# EAGLE schematic Complete_Board_Two_Multiplexers (EAGLE 9.3.0), part 1 of 3
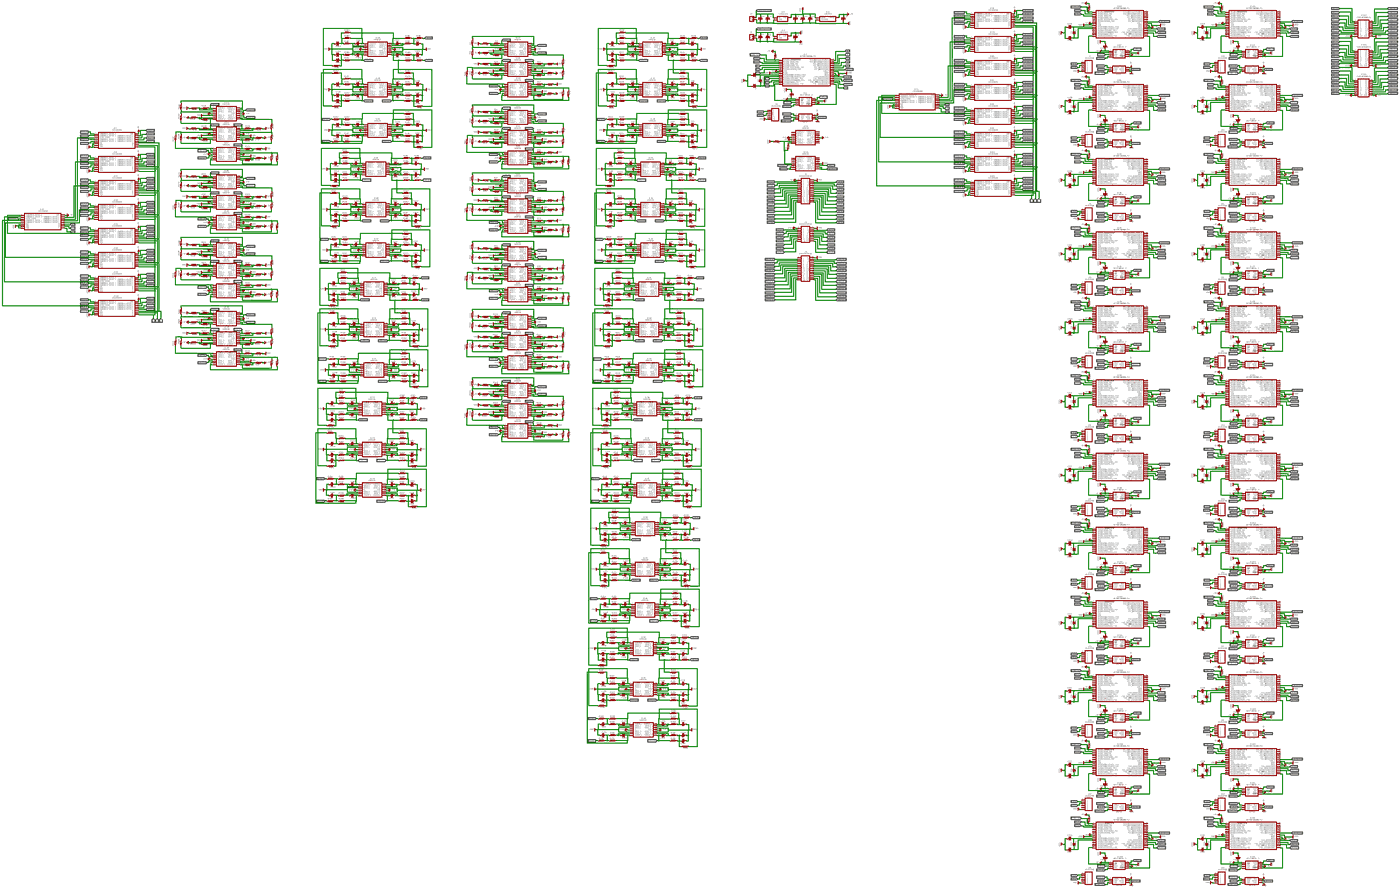
[diagram p0: schematic, sheet 1, overview]
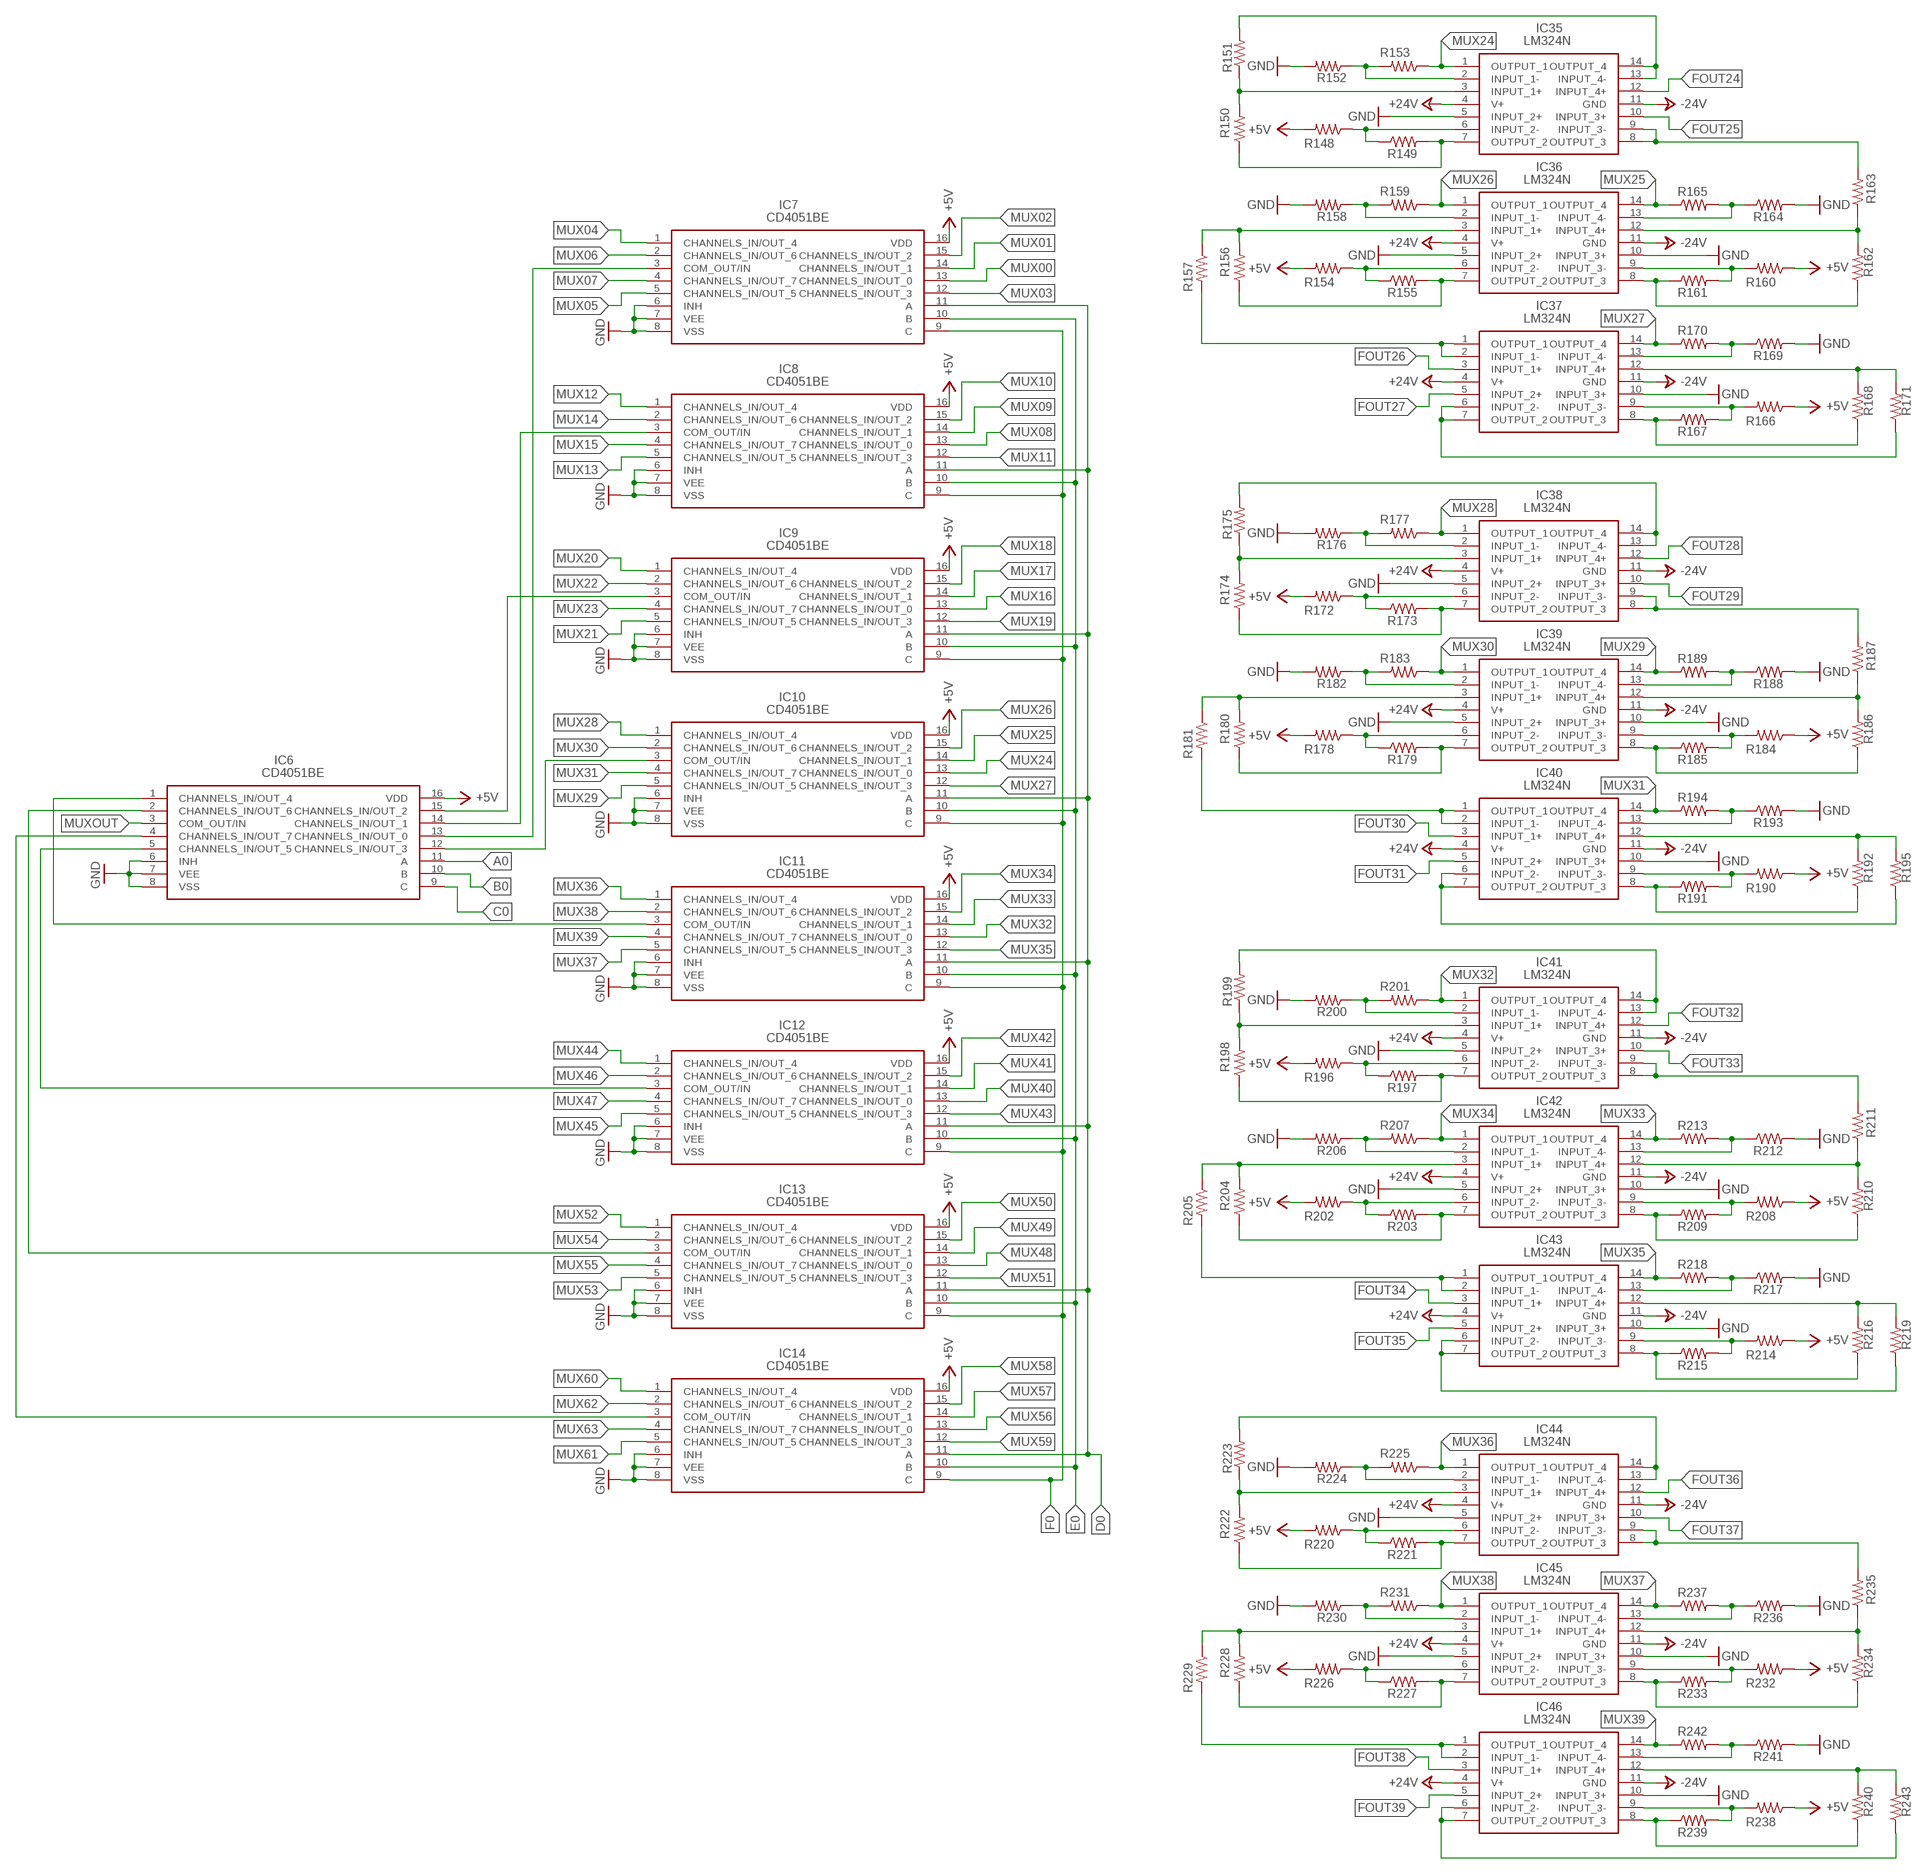
[diagram p1: schematic, sheet 1, part 1 of 8]
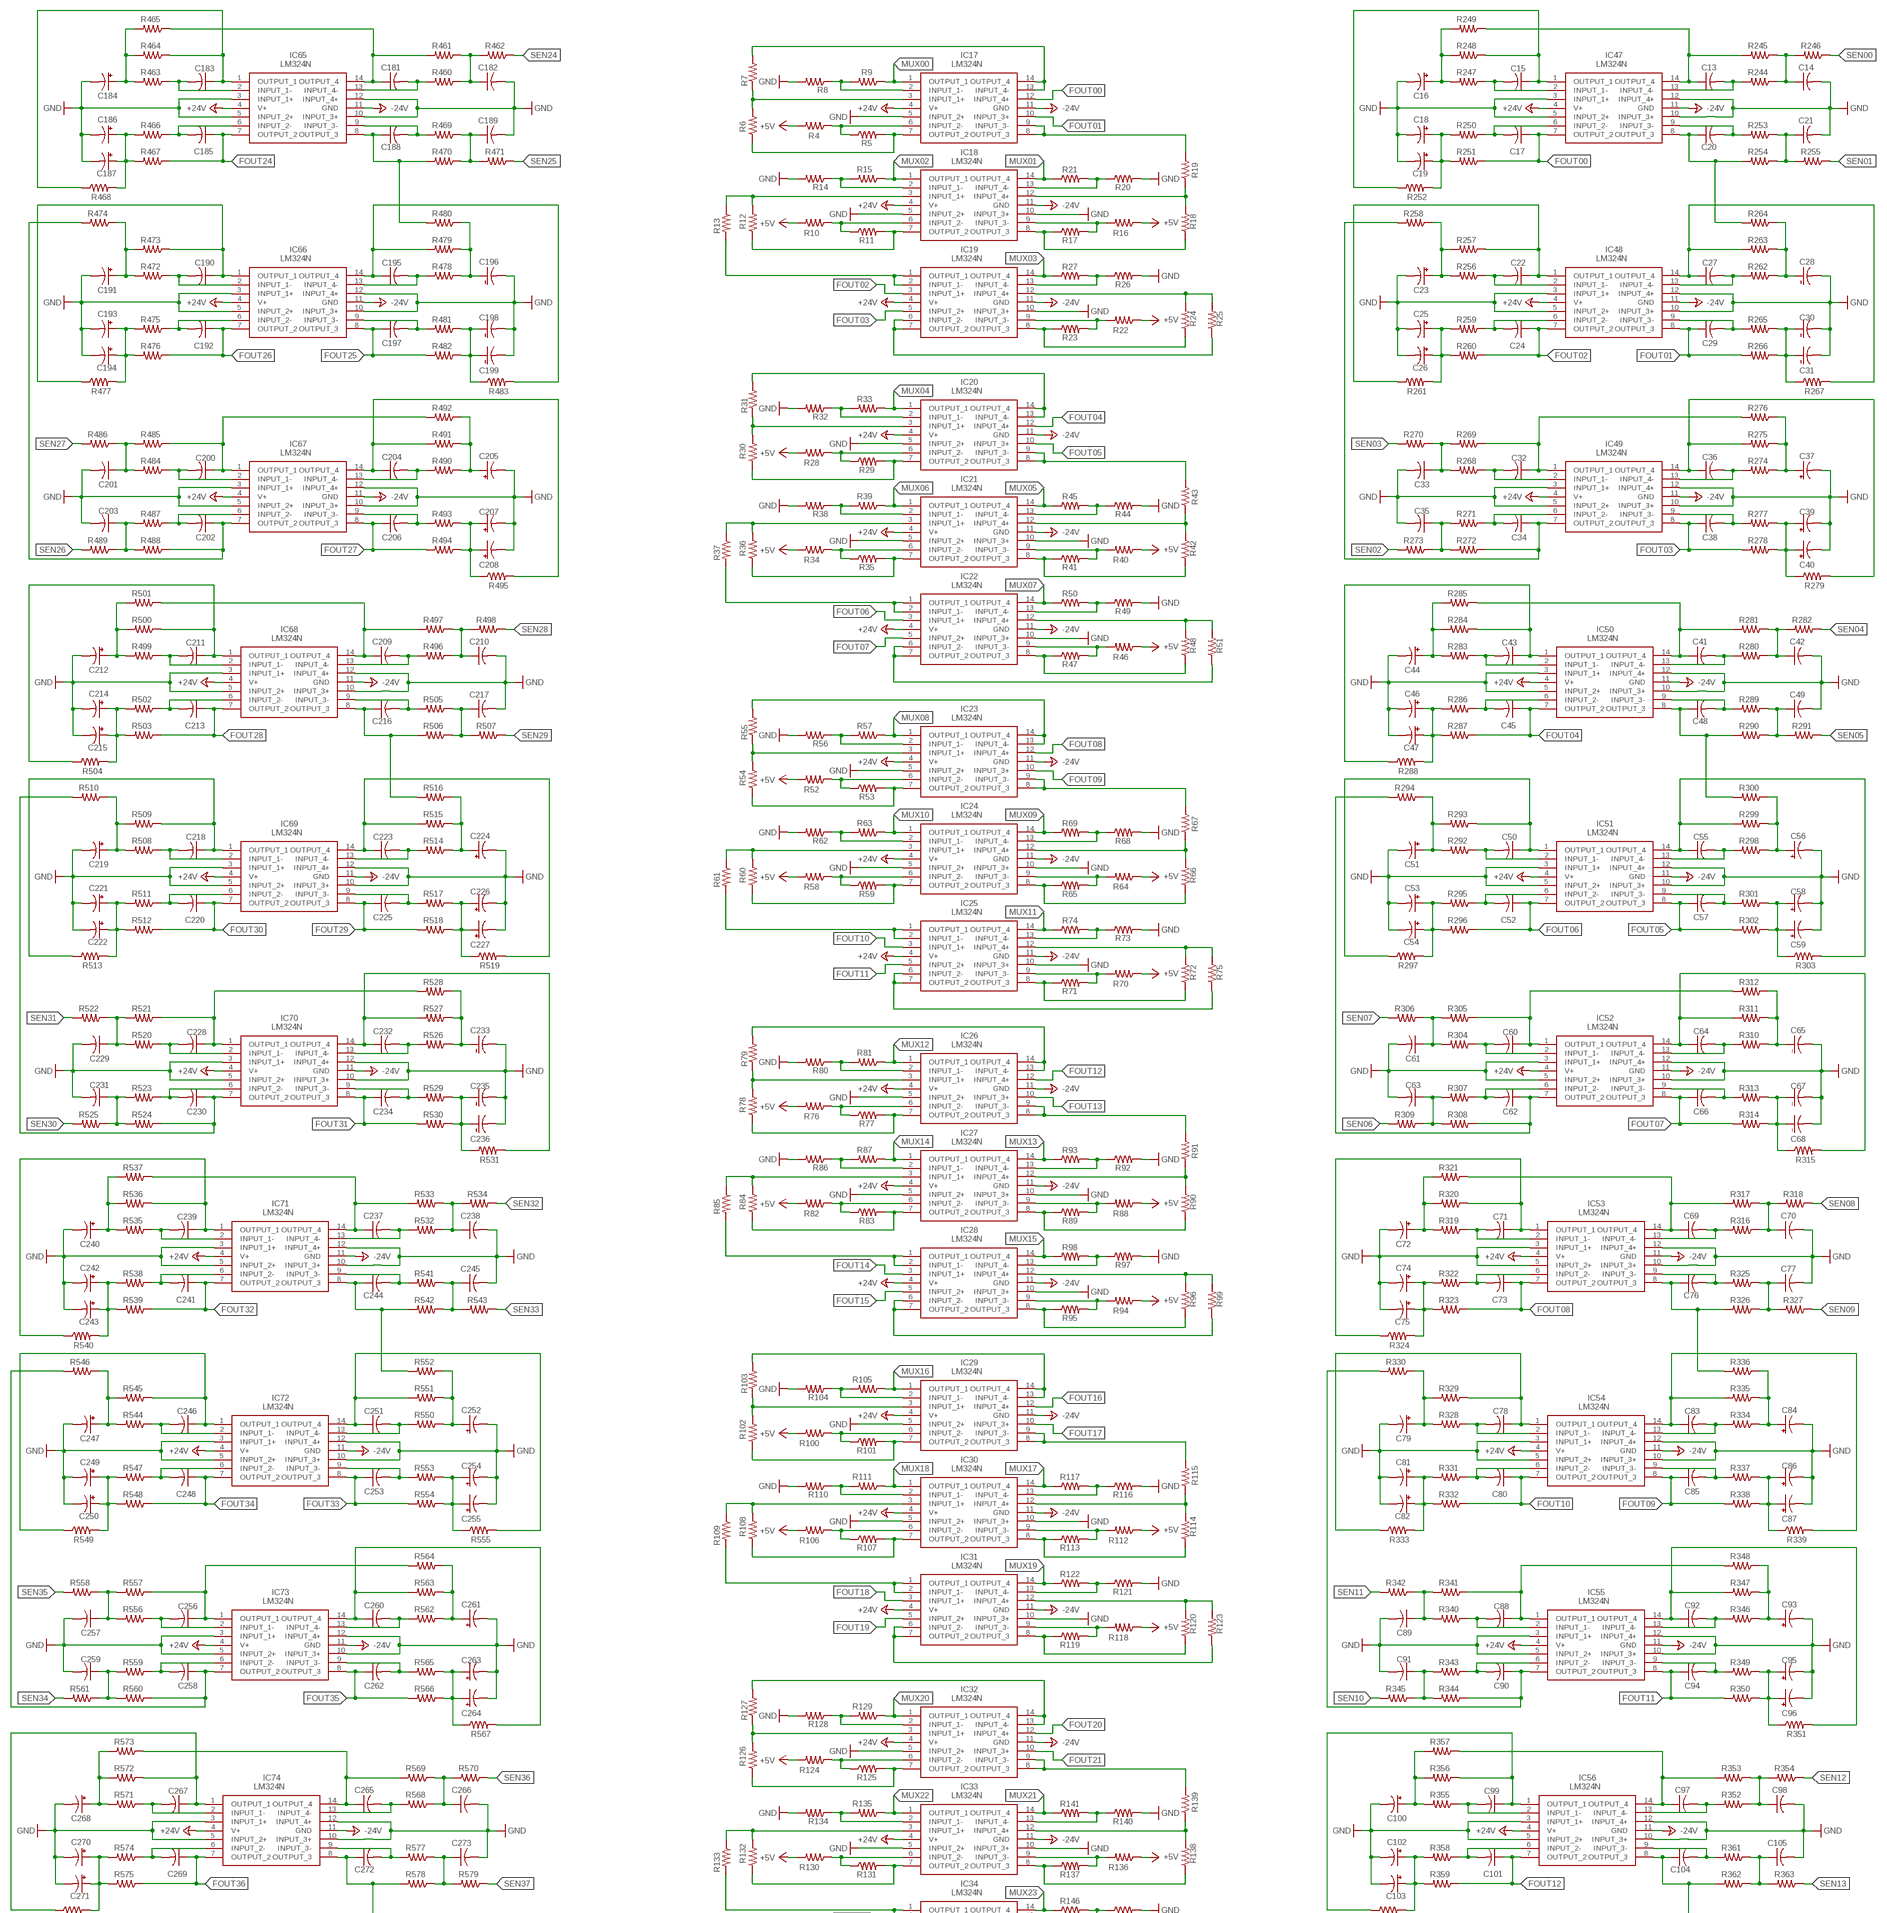
[diagram p2: schematic, sheet 1, part 2 of 8]
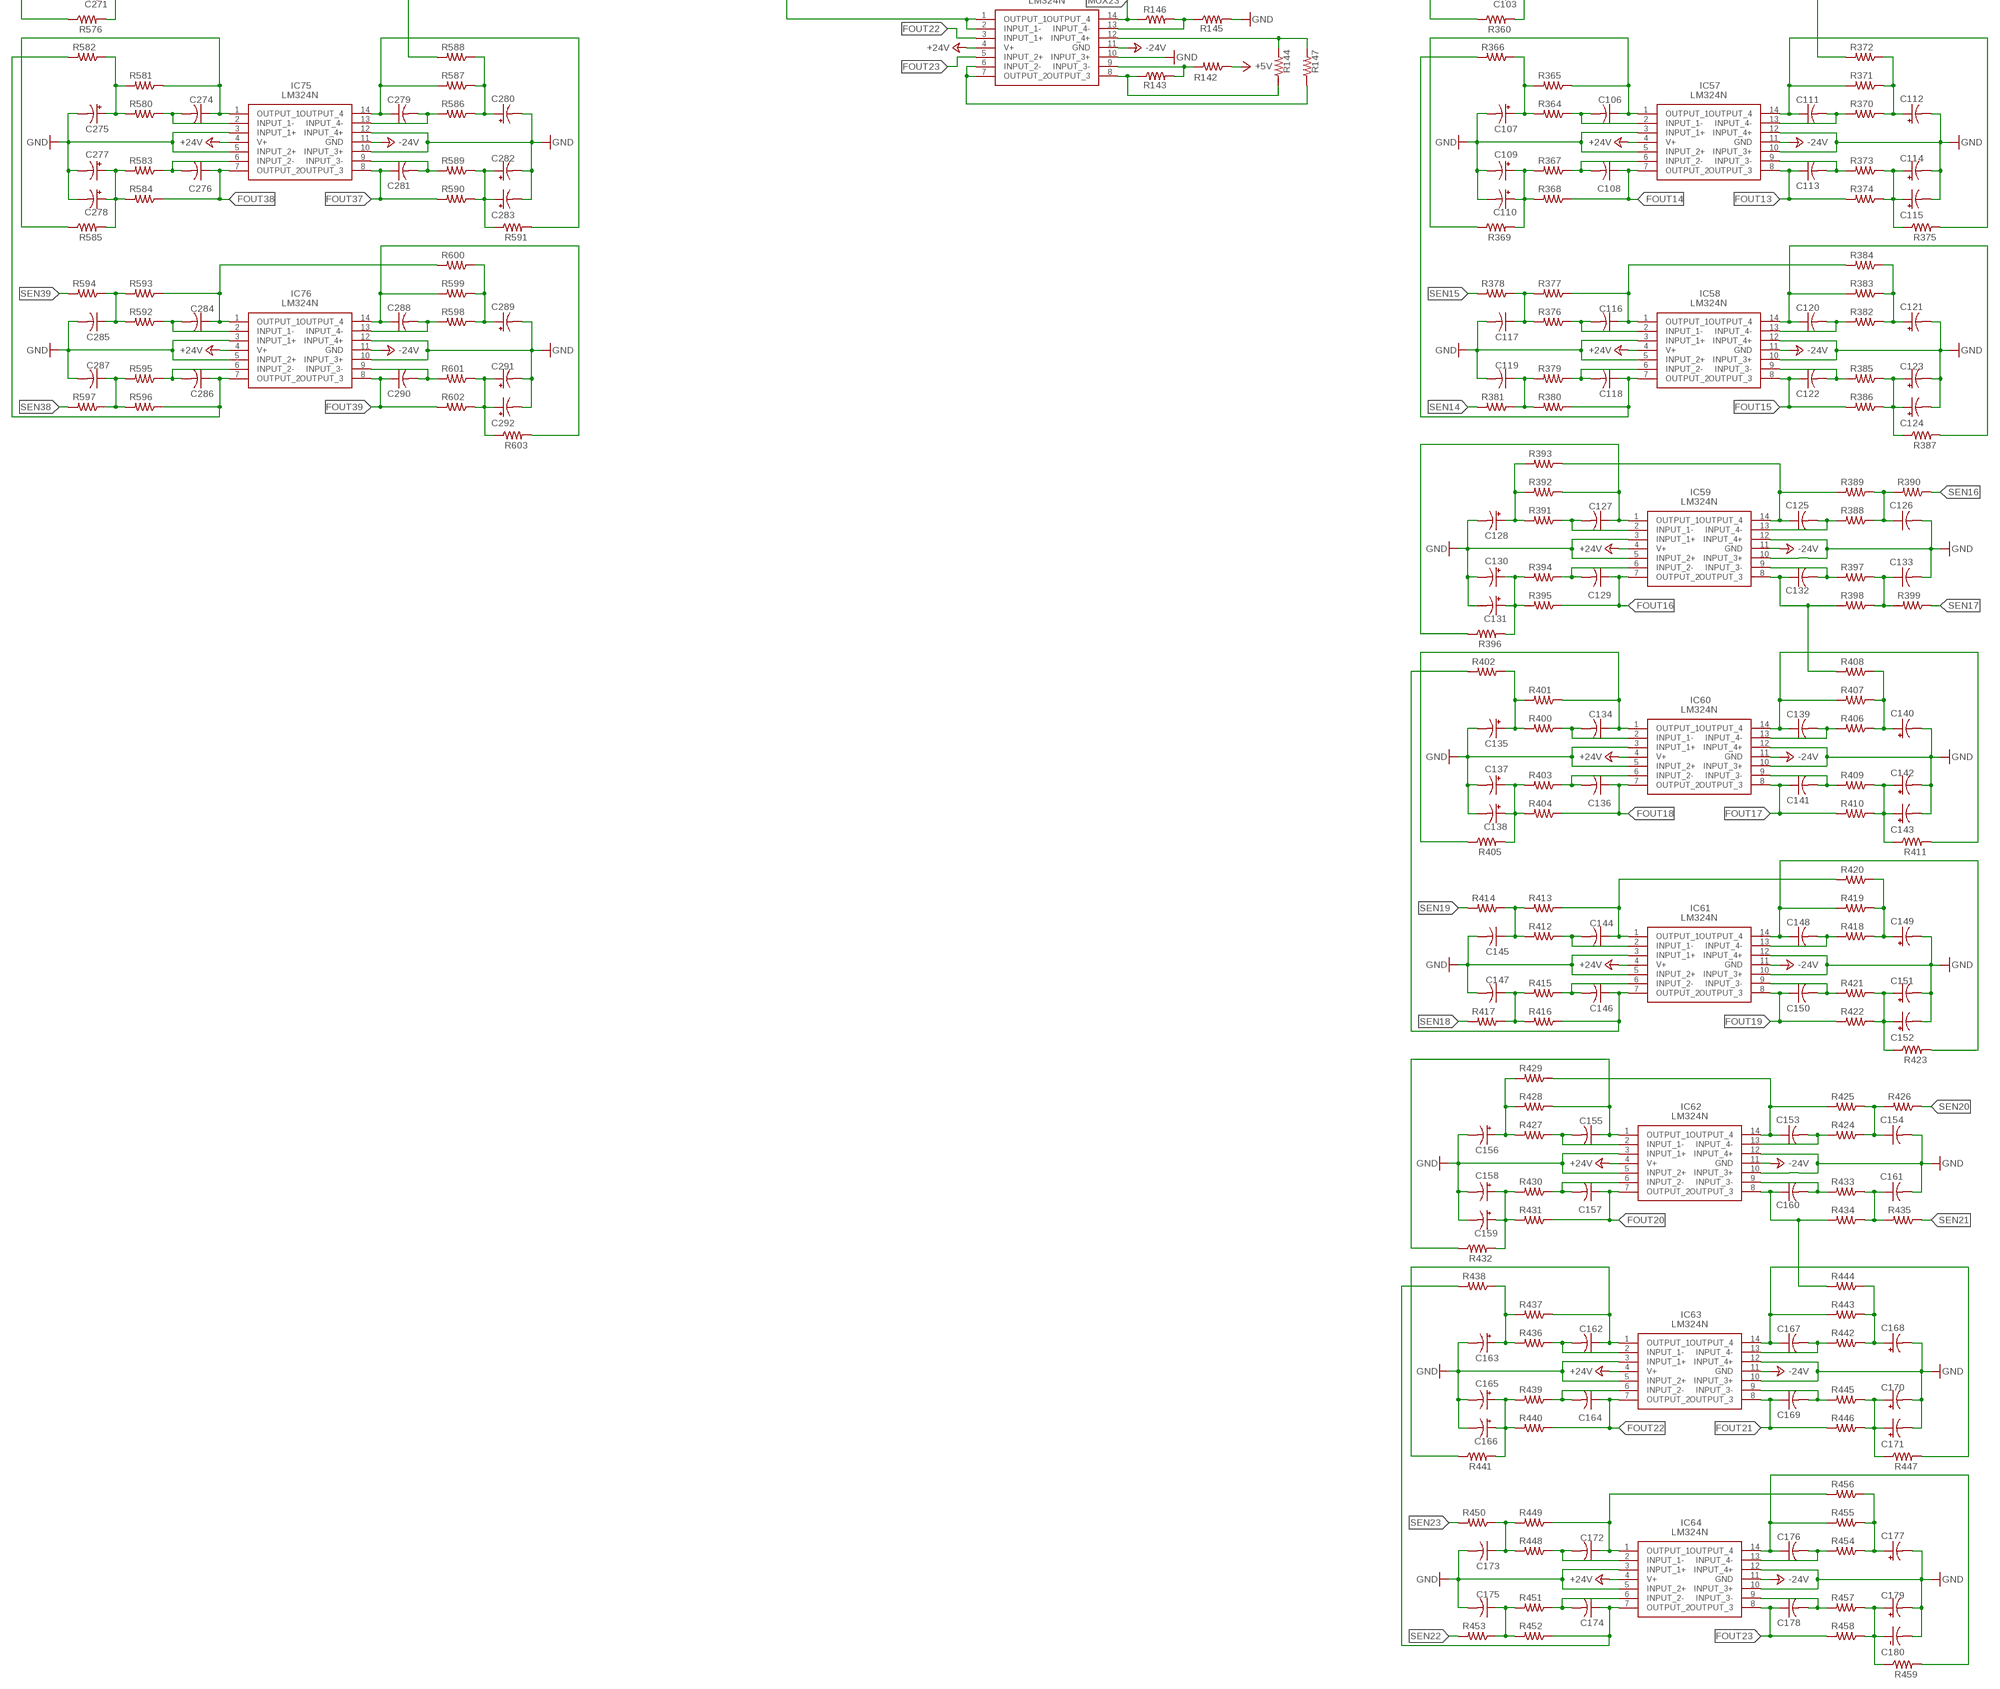
[diagram p3: schematic, sheet 1, part 3 of 8]
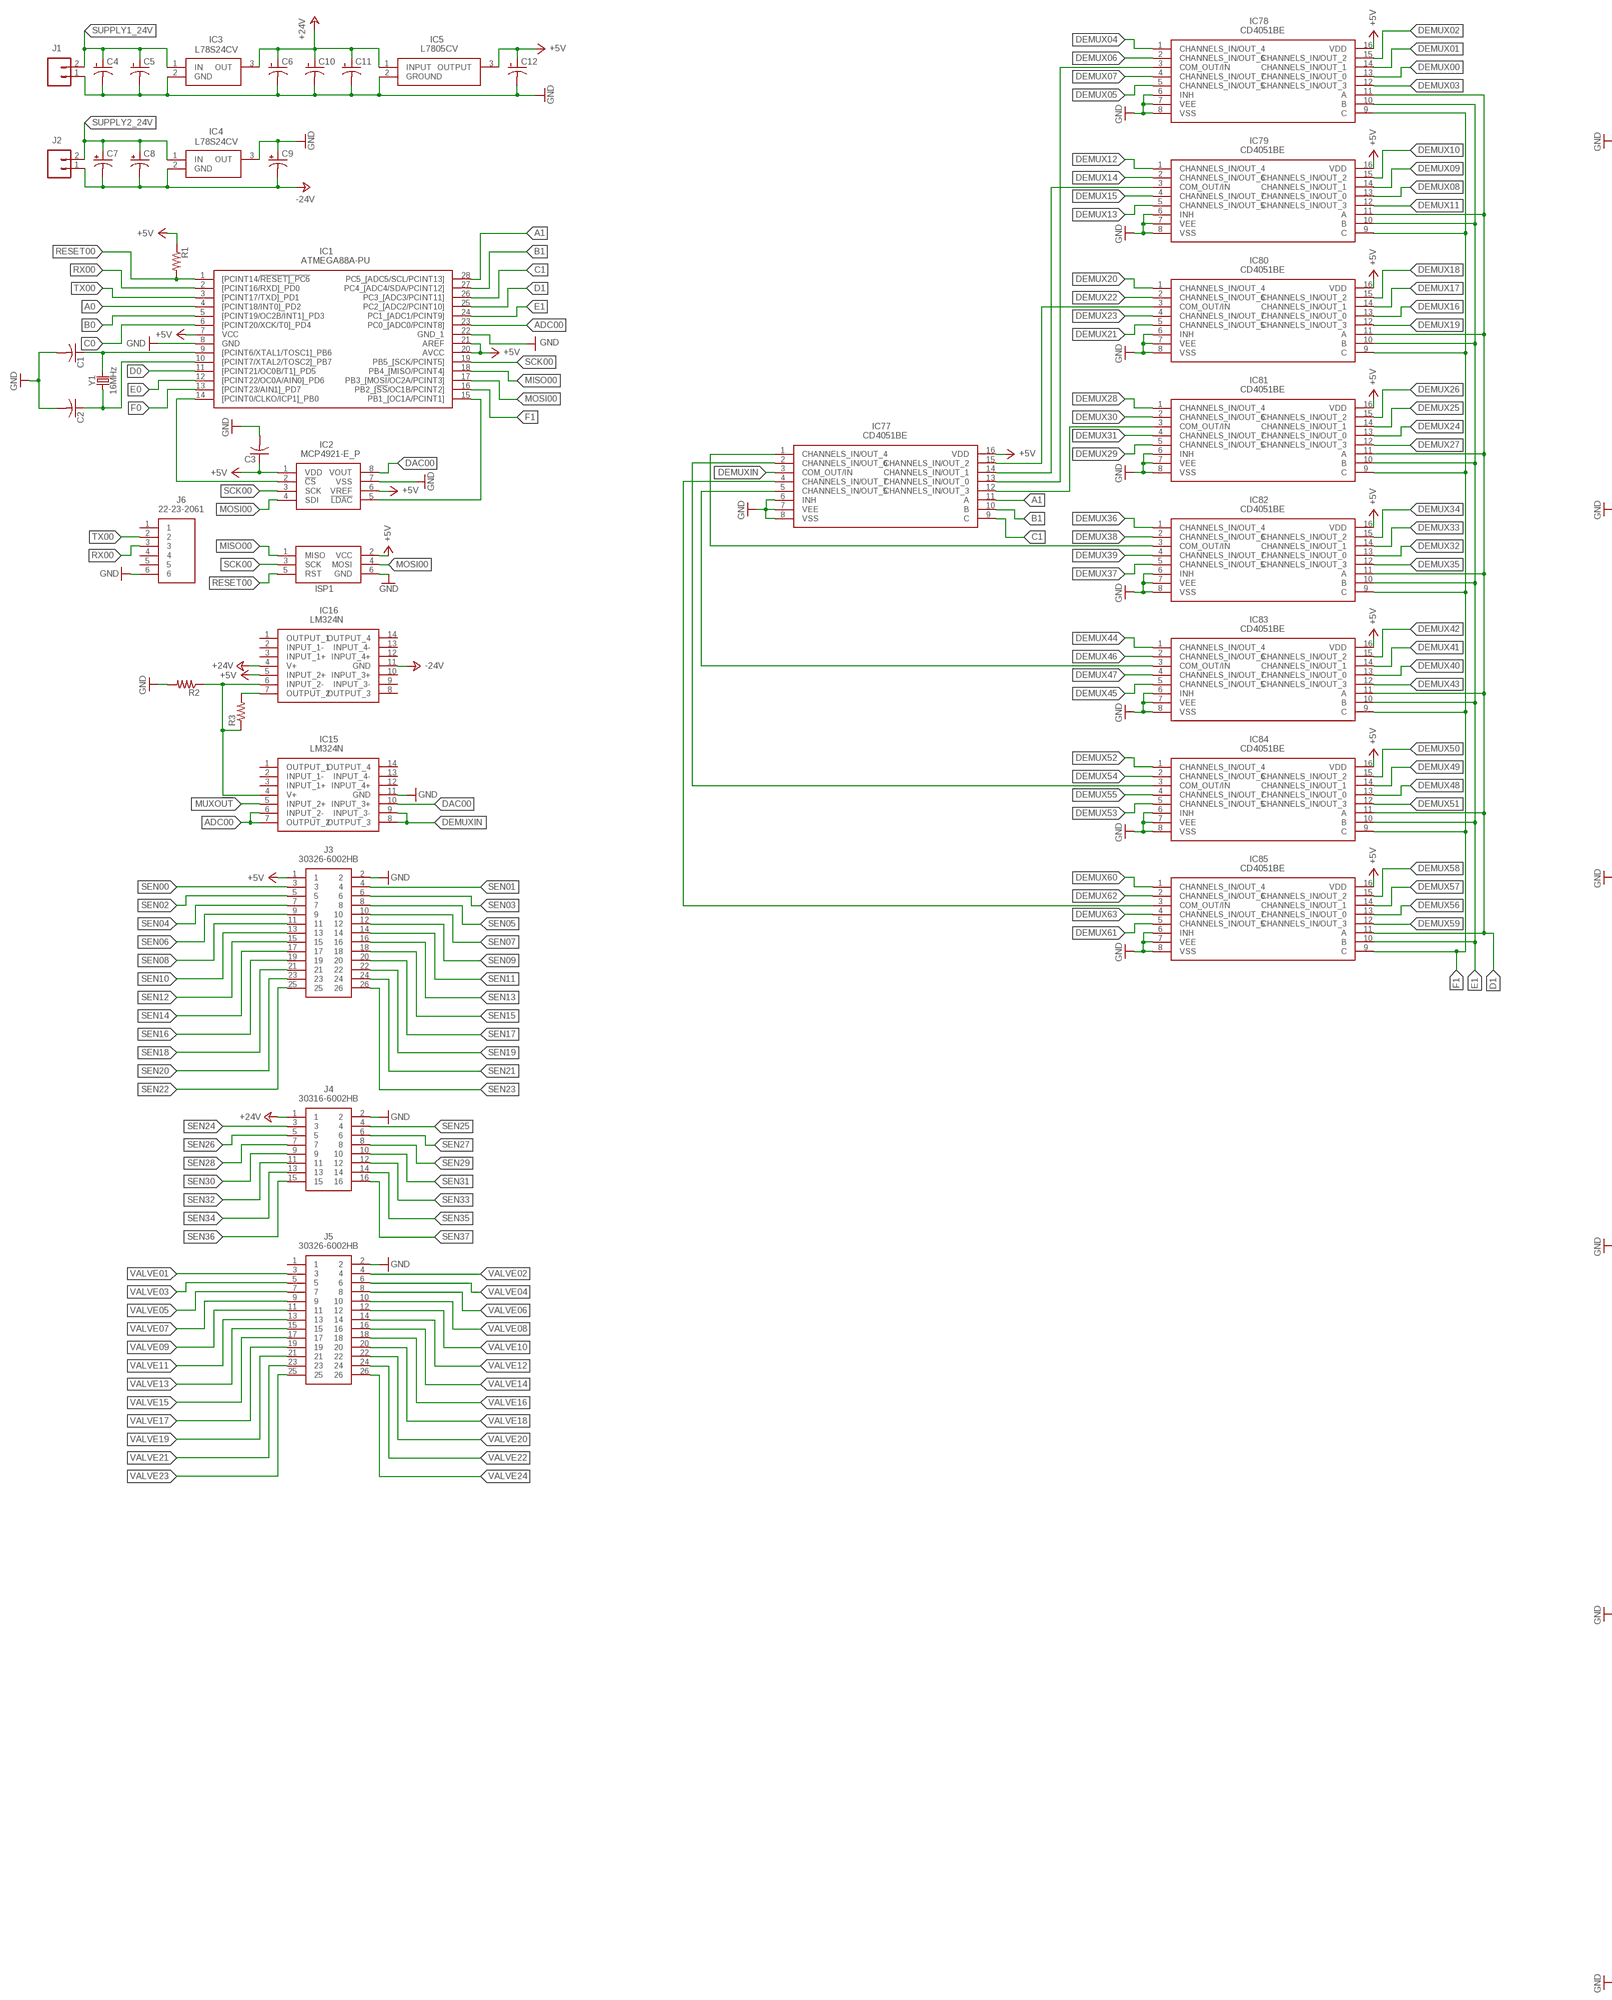
[diagram p4: schematic, sheet 1, part 4 of 8]
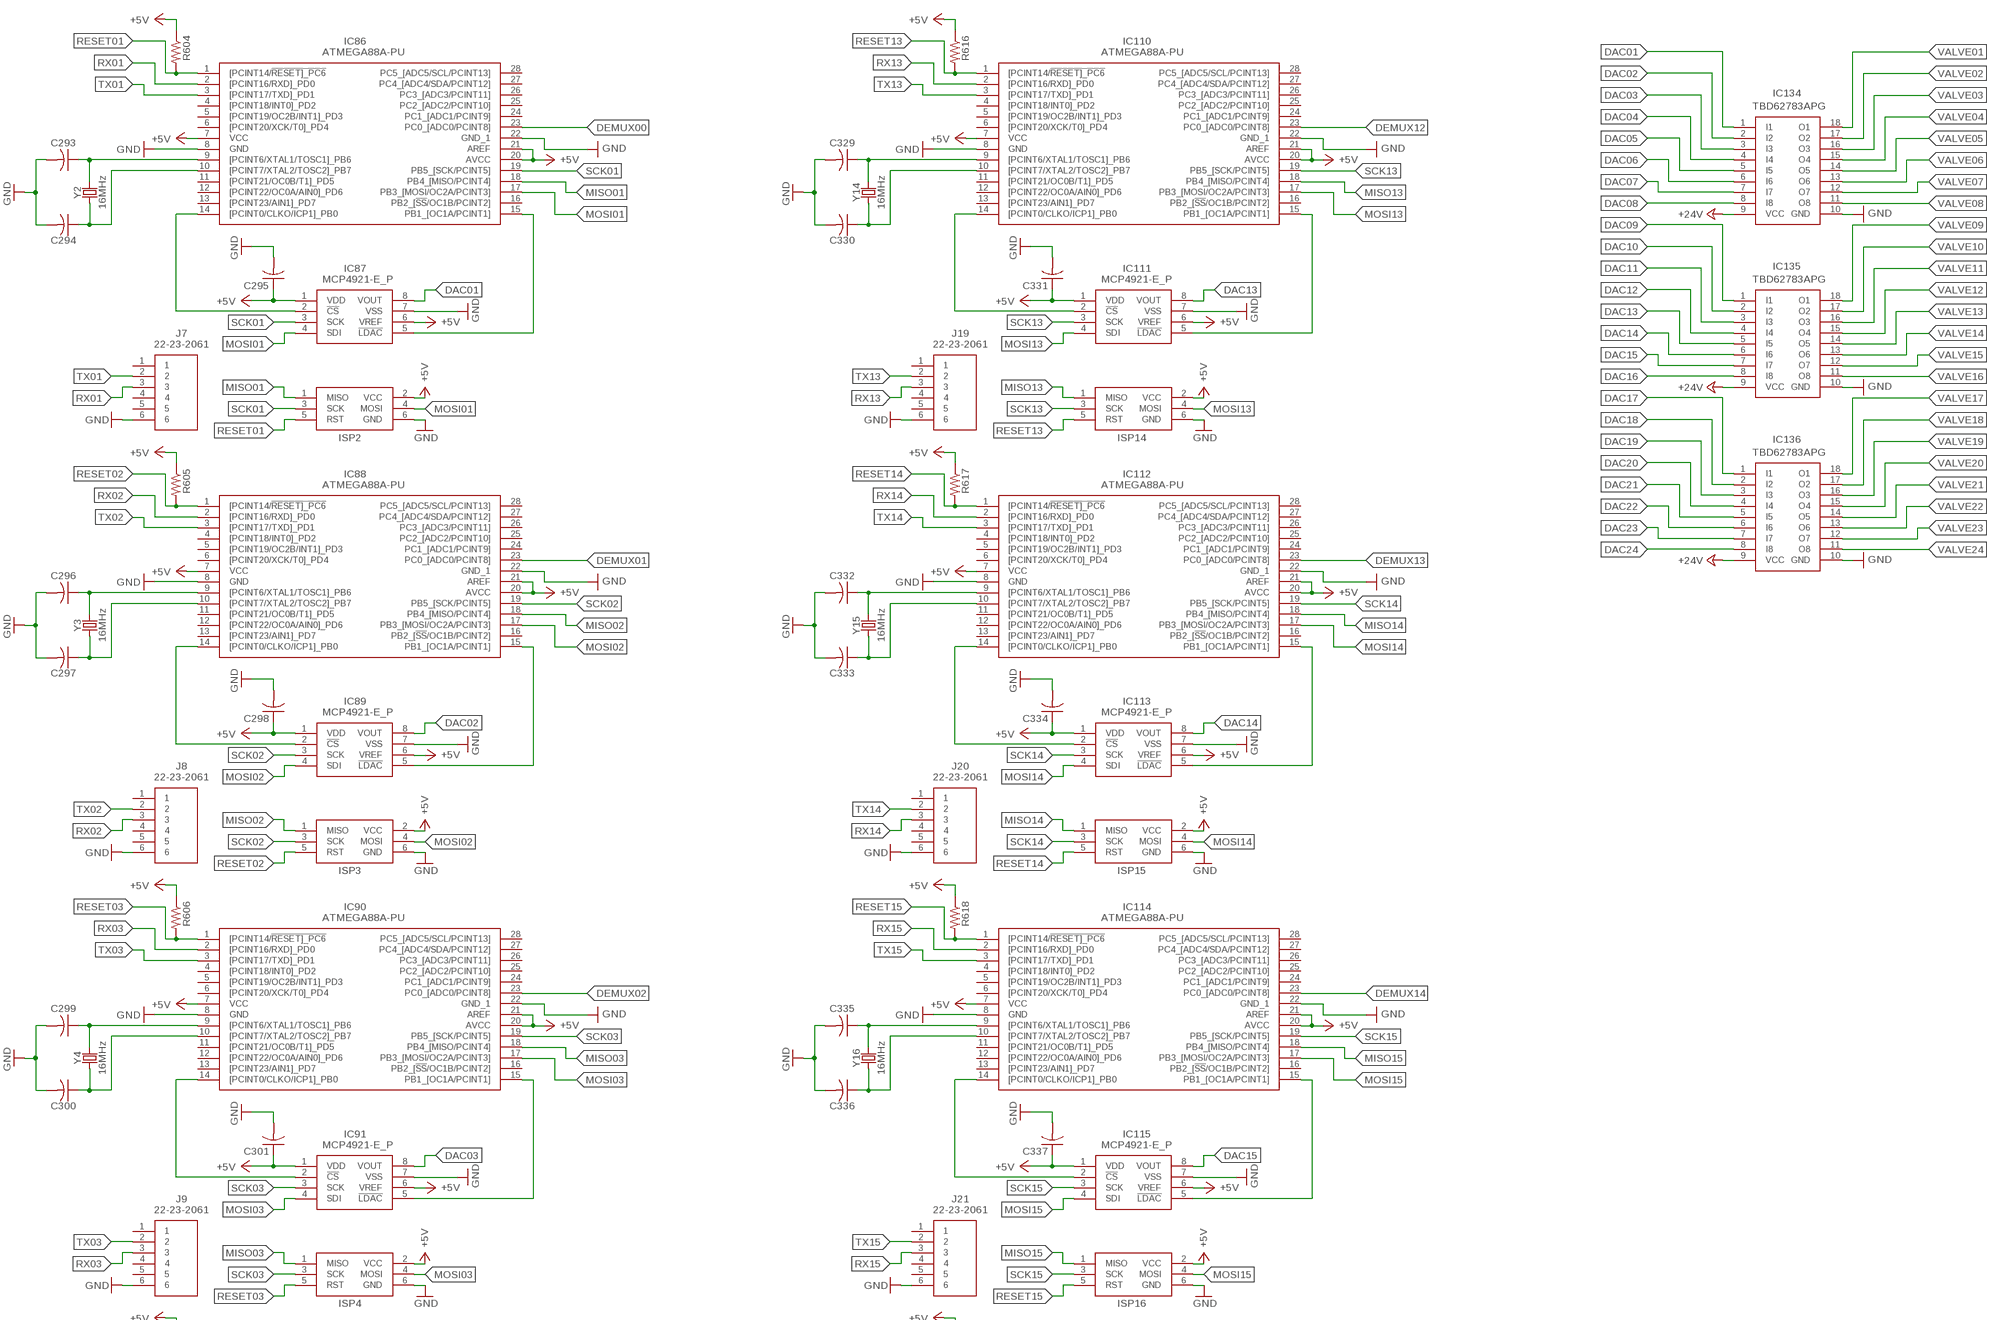
[diagram p5: schematic, sheet 1, part 5 of 8]
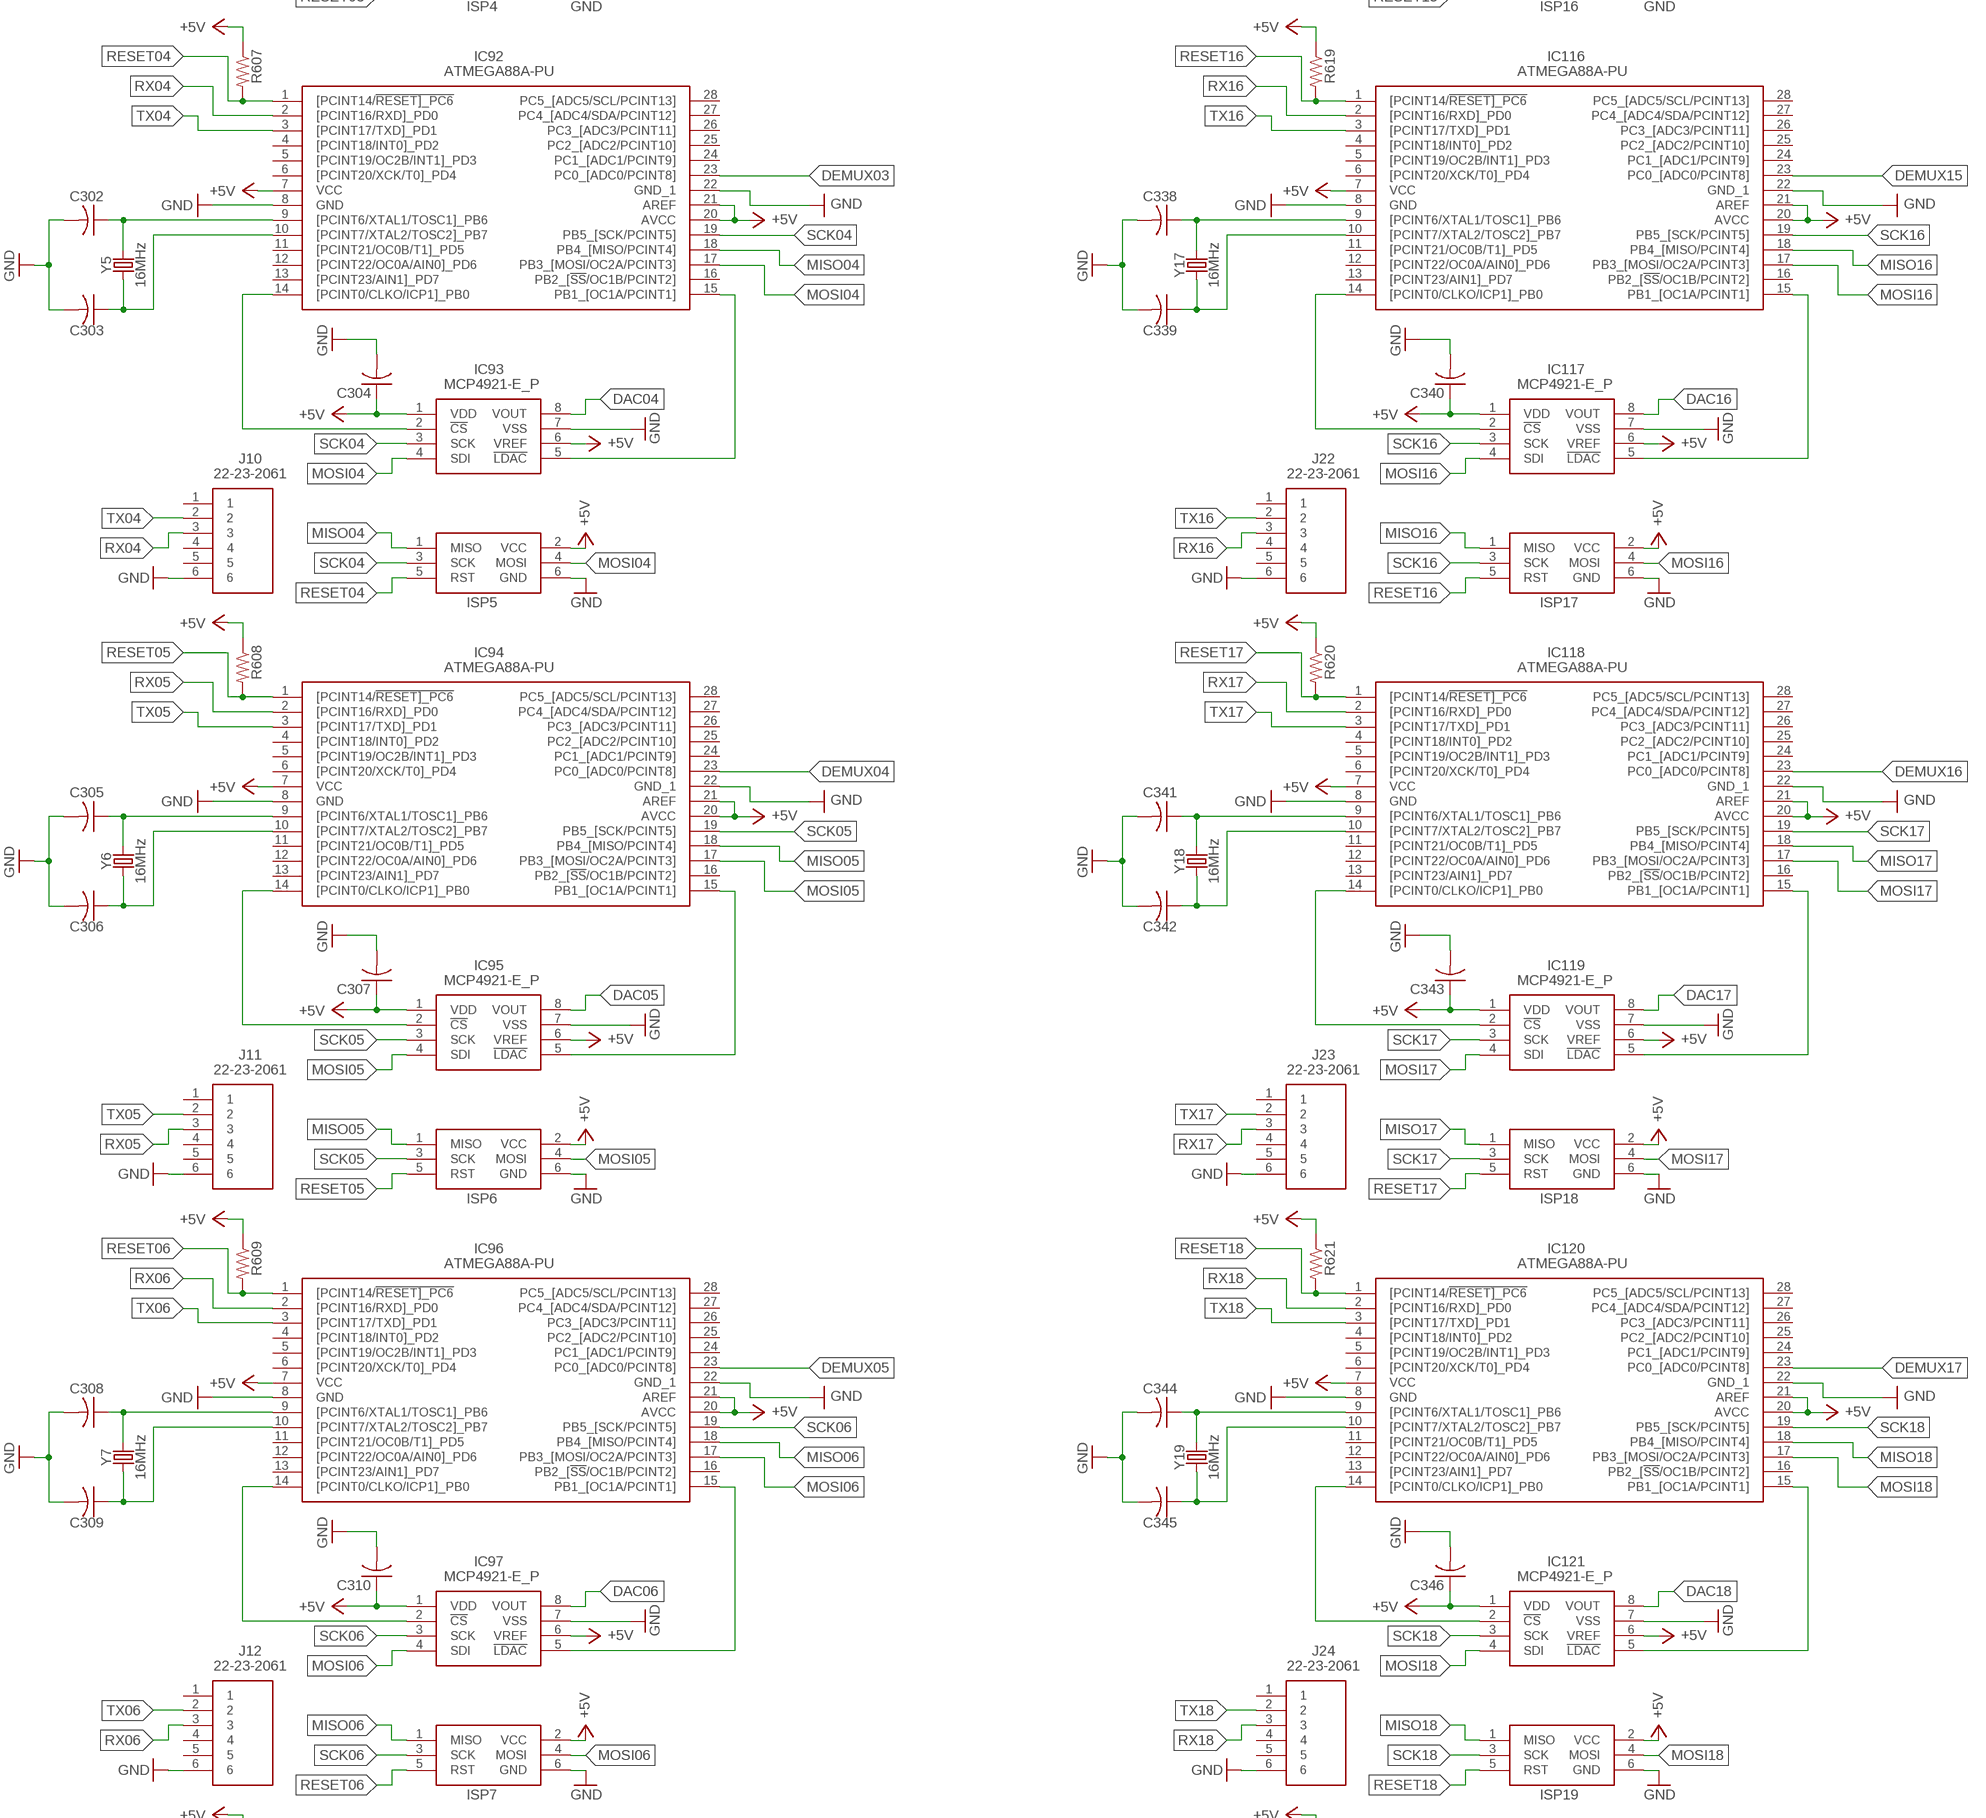
[diagram p6: schematic, sheet 1, part 6 of 8]
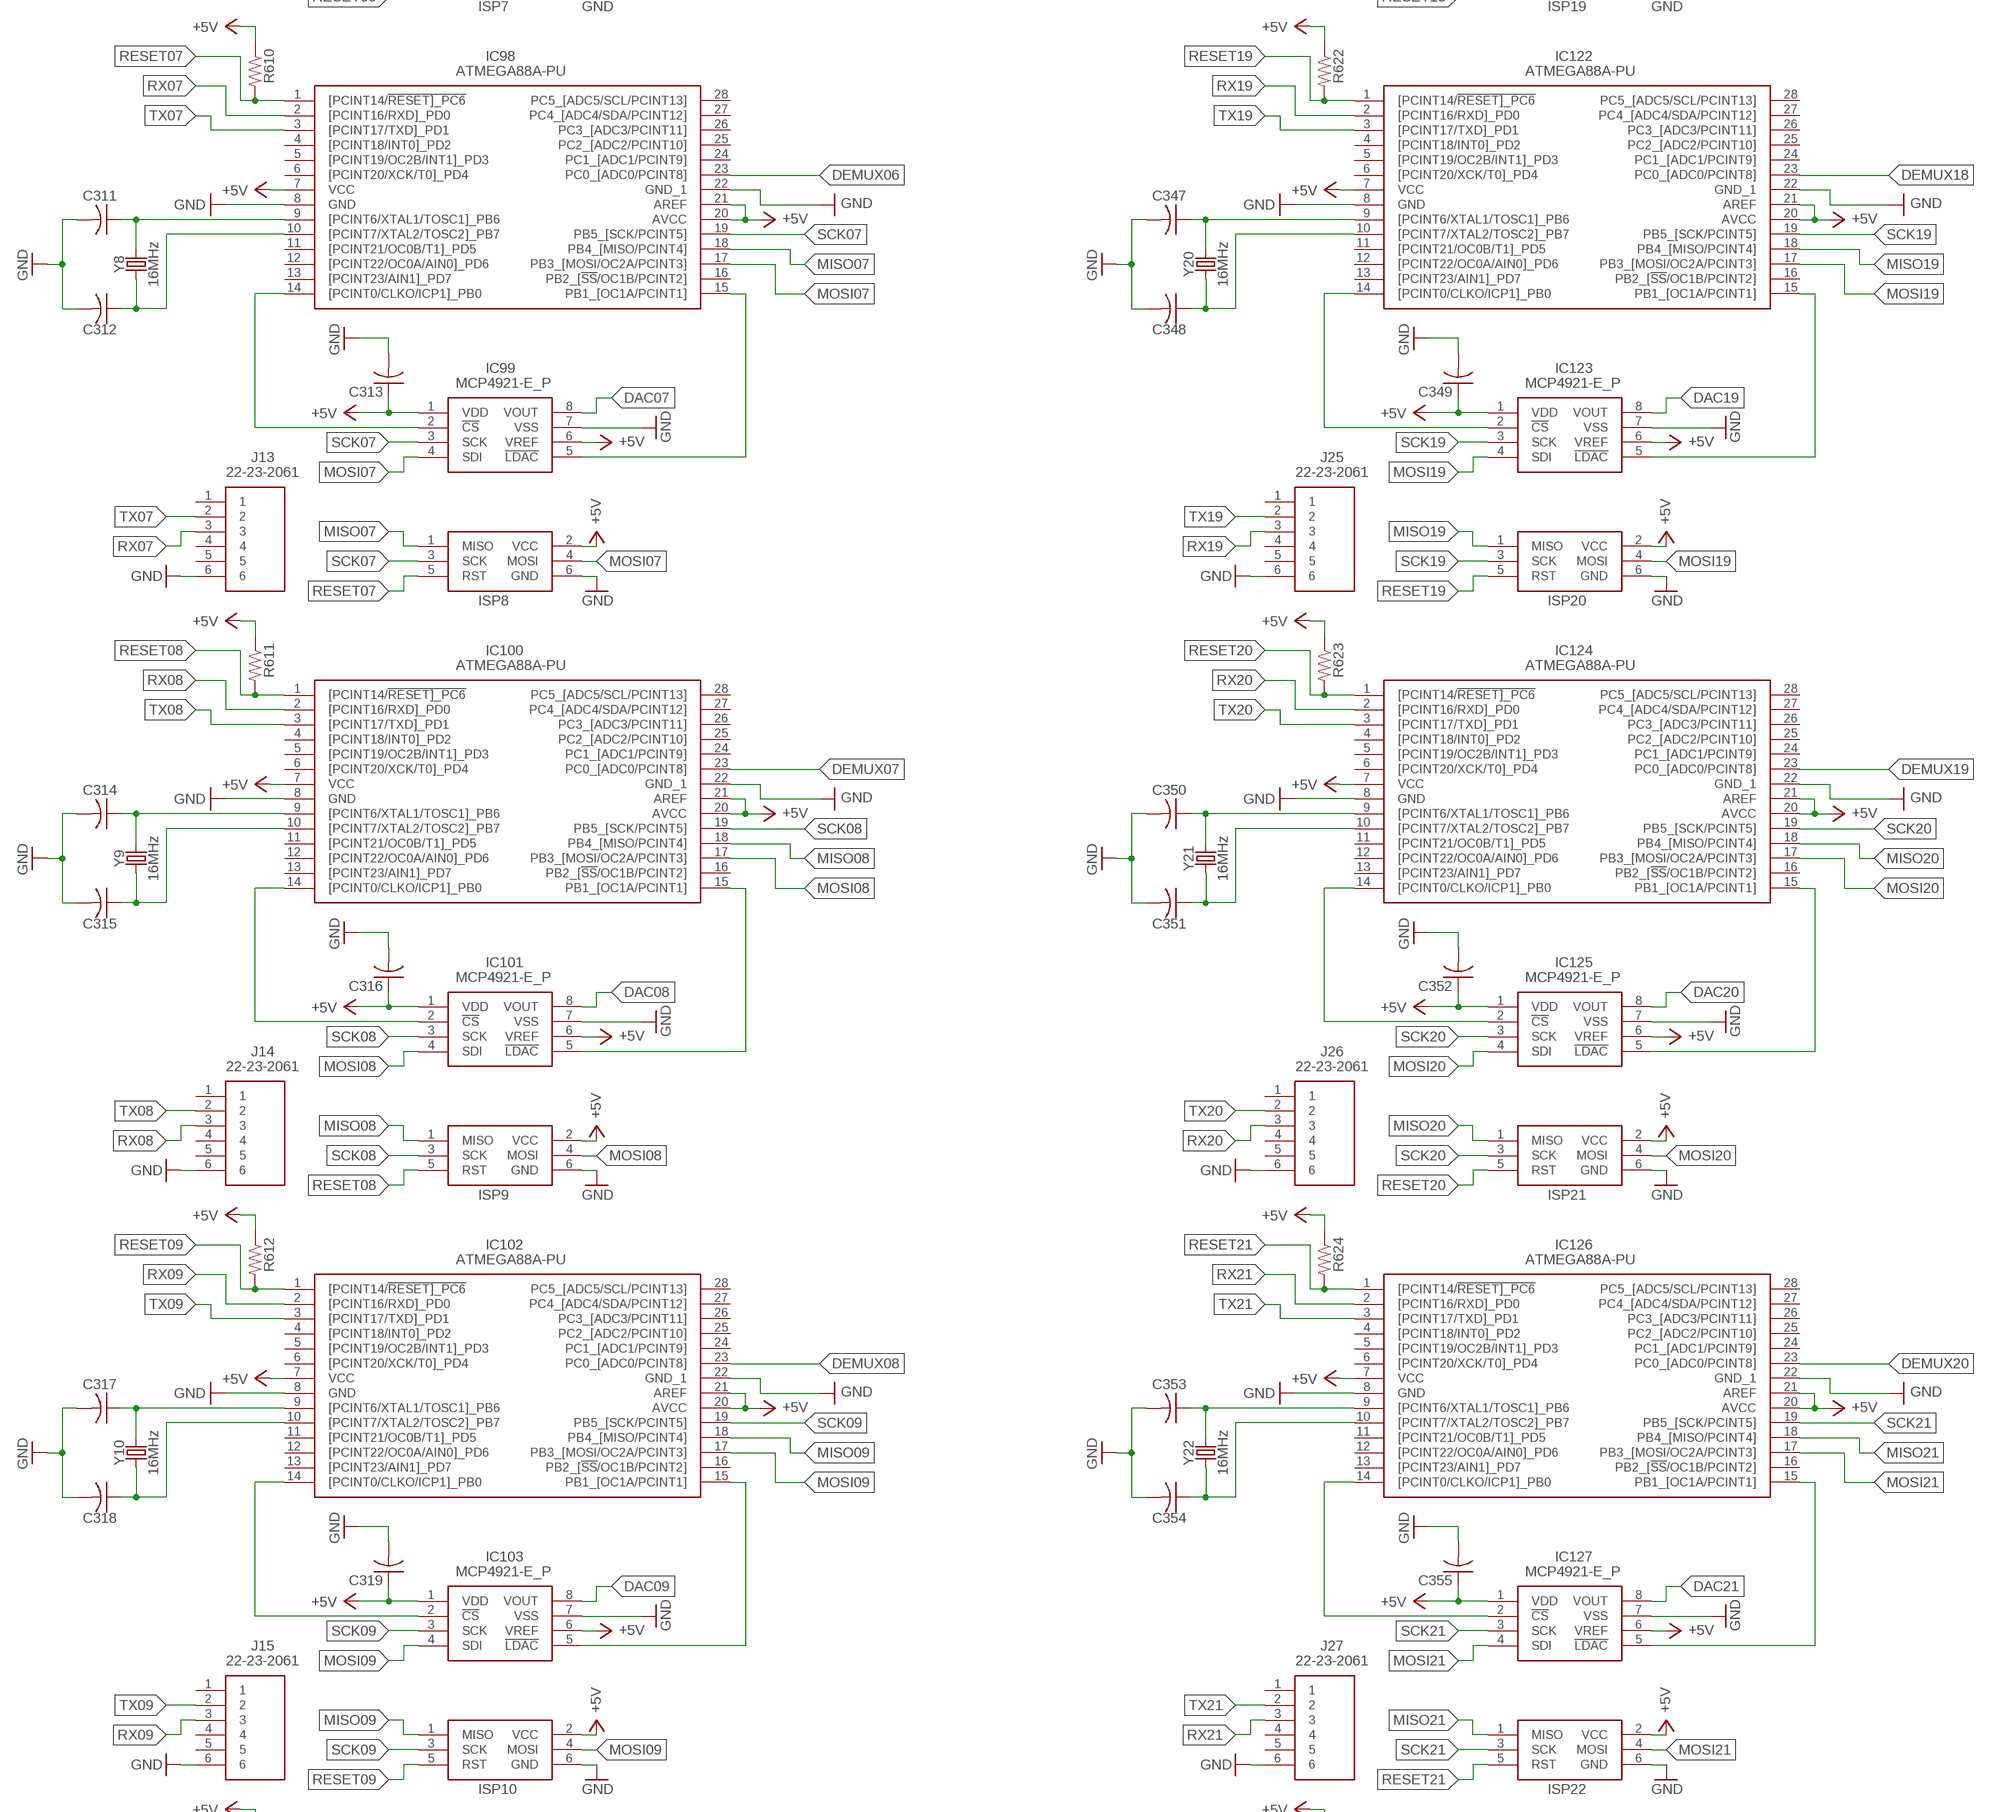
[diagram p7: schematic, sheet 1, part 7 of 8]
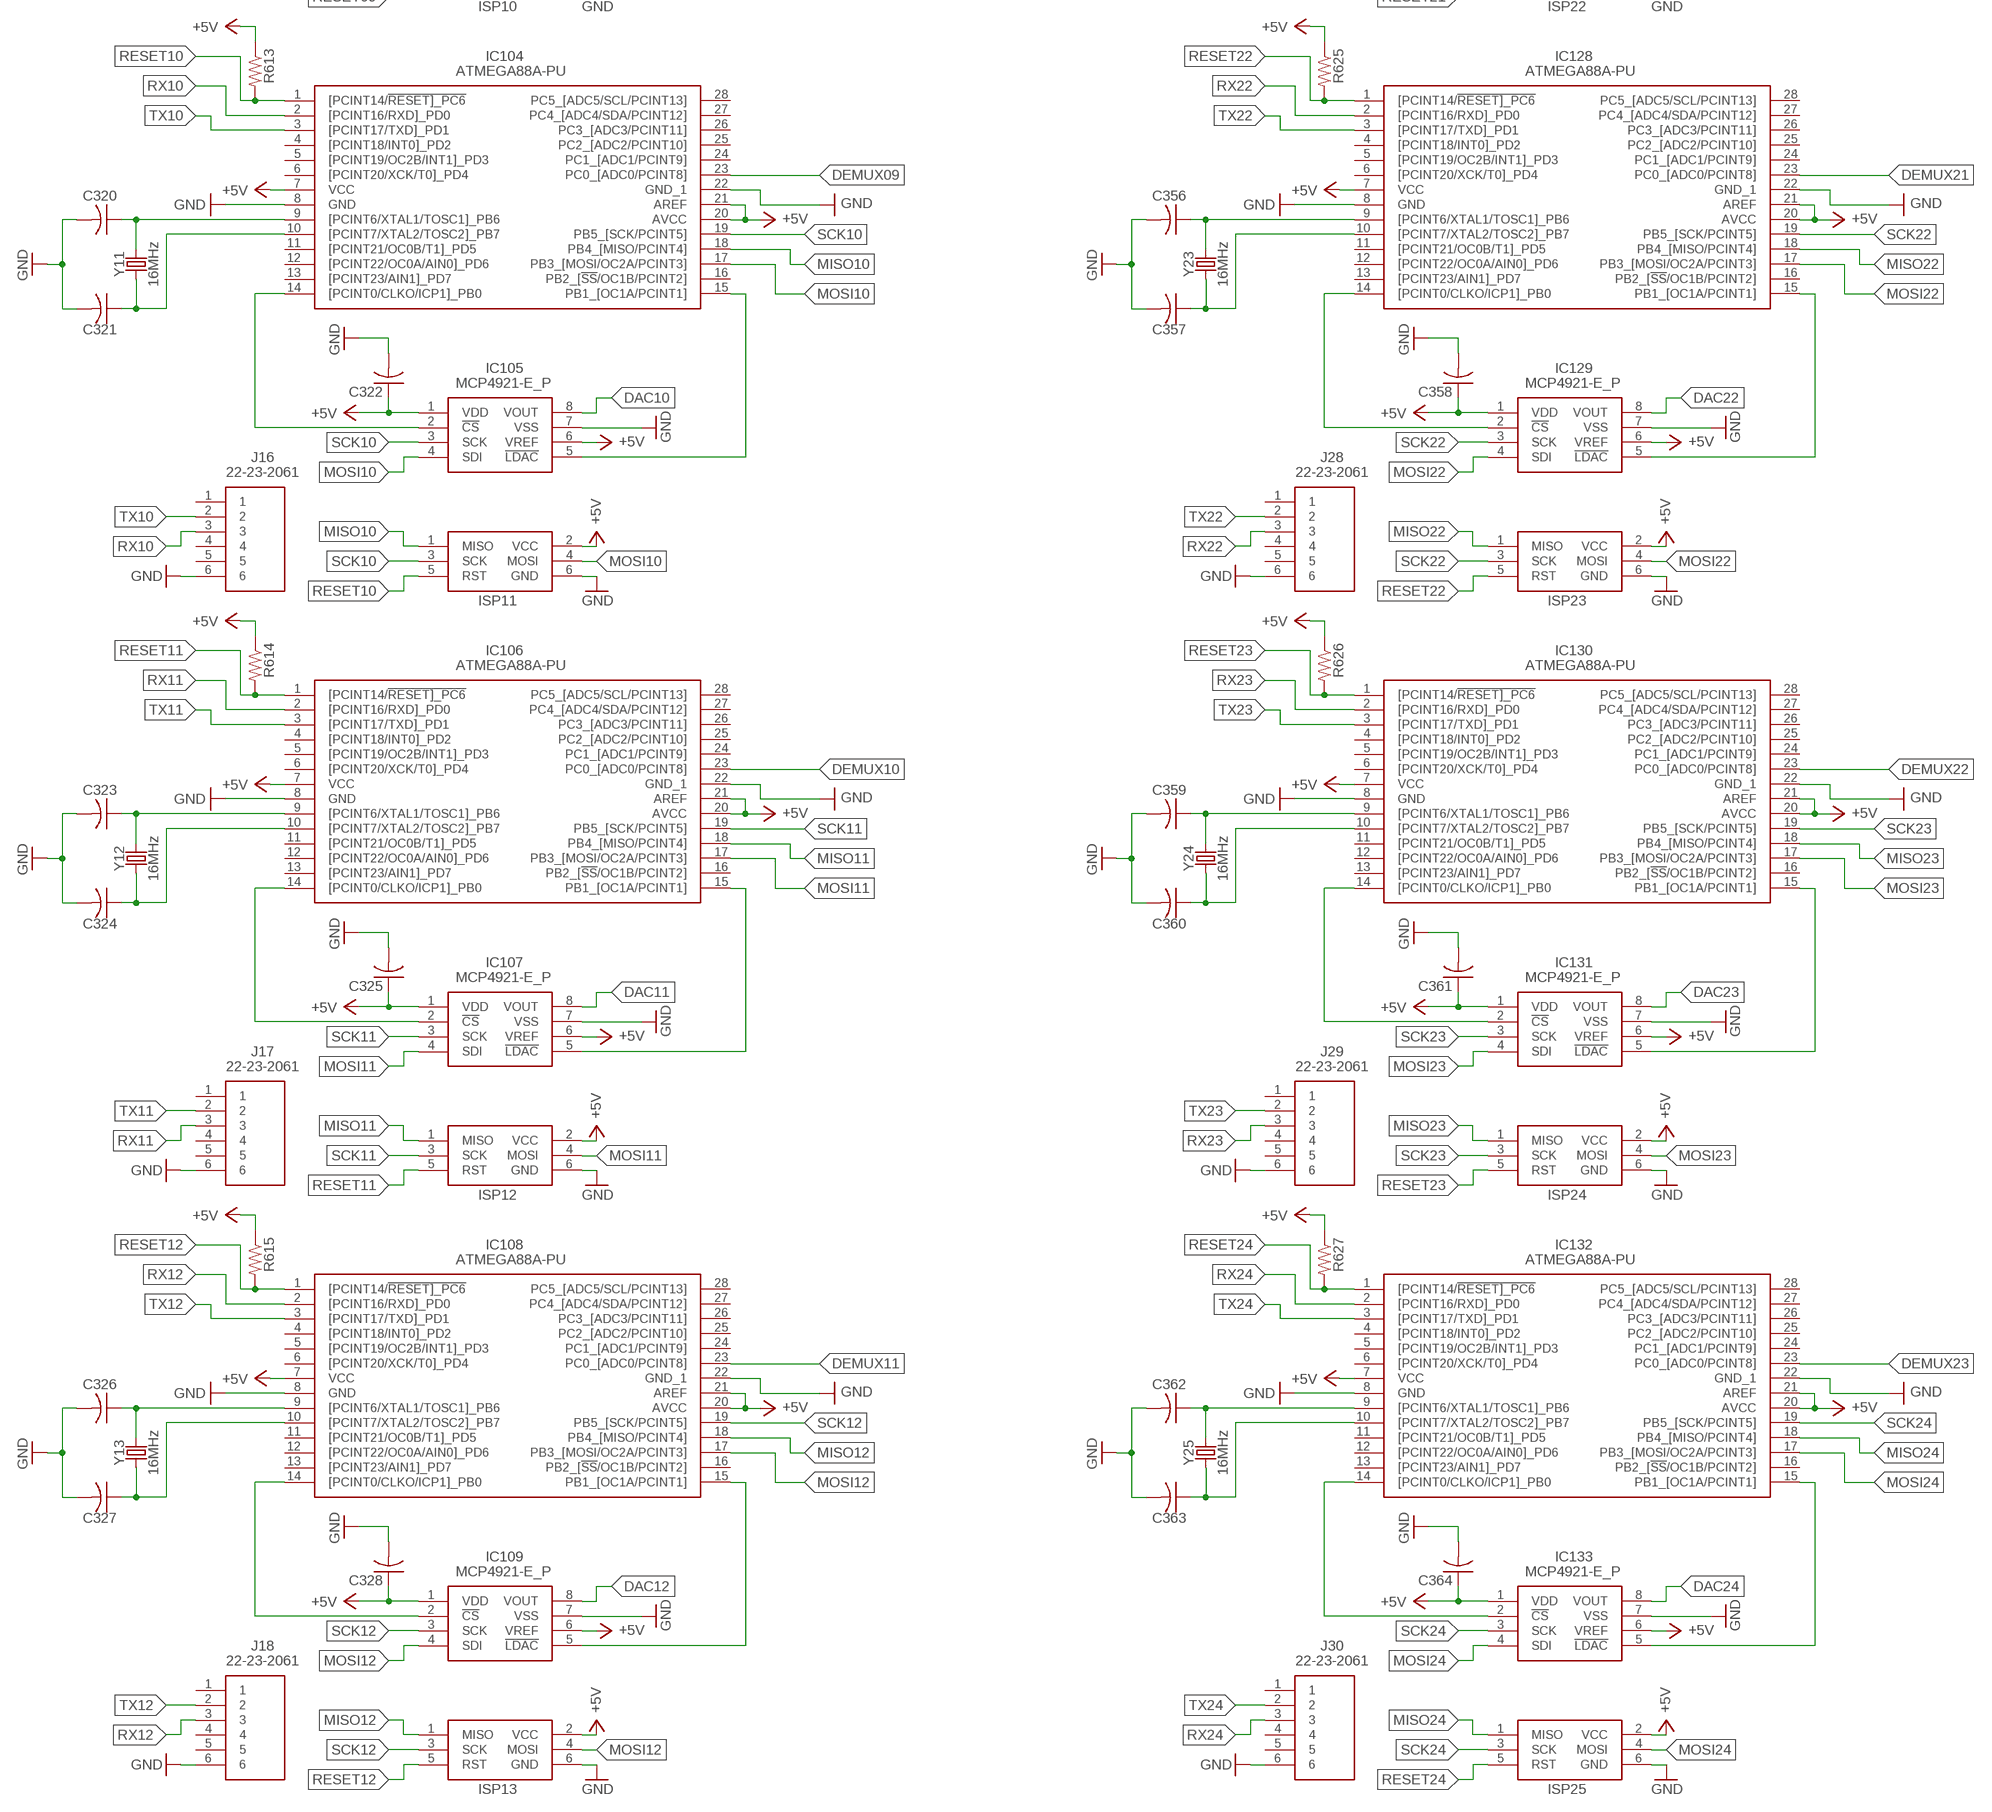
[diagram p8: schematic, sheet 1, part 8 of 8]

## Parts
C1  C-US050-030X075  [C050-030X075]
C2  C-US050-030X075  [C050-030X075]
C3  C-US050-030X075  [C050-030X075]
C4  CPOL-USE2.5-7  [E2,5-7]
C5  CPOL-USE2.5-7  [E2,5-7]
C6  CPOL-USE2.5-5  [E2,5-5]
C7  CPOL-USE2.5-7  [E2,5-7]
C8  CPOL-USE2.5-7  [E2,5-7]
C9  CPOL-USE2.5-5  [E2,5-5]
C10  CPOL-USE2.5-7  [E2,5-7]
C11  CPOL-USE2.5-7  [E2,5-7]
C12  CPOL-USE2.5-5  [E2,5-5]
C13  C-US050-030X075  [C050-030X075]
C14  C-US050-030X075  [C050-030X075]
C15  C-US050-030X075  [C050-030X075]
C16  CPOL-USE2.5-5  [E2,5-5]
C17  C-US050-030X075  [C050-030X075]
C18  CPOL-USE2.5-7  [E2,5-7]
C19  CPOL-USE2.5-7  [E2,5-7]
C20  C-US050-030X075  [C050-030X075]
C21  C-US050-030X075  [C050-030X075]
C22  C-US050-030X075  [C050-030X075]
C23  CPOL-USE2.5-5  [E2,5-5]
C24  C-US050-030X075  [C050-030X075]
C25  CPOL-USE2.5-7  [E2,5-7]
C26  CPOL-USE2.5-7  [E2,5-7]
C27  C-US050-030X075  [C050-030X075]
C28  CPOL-USE2.5-5  [E2,5-5]
C29  C-US050-030X075  [C050-030X075]
C30  CPOL-USE2.5-7  [E2,5-7]
C31  CPOL-USE2.5-7  [E2,5-7]
C32  C-US050-030X075  [C050-030X075]
C33  C-US050-030X075  [C050-030X075]
C34  C-US050-030X075  [C050-030X075]
C35  C-US050-030X075  [C050-030X075]
C36  C-US050-030X075  [C050-030X075]
C37  CPOL-USE2.5-5  [E2,5-5]
C38  C-US050-030X075  [C050-030X075]
C39  CPOL-USE2.5-7  [E2,5-7]
C40  CPOL-USE2.5-7  [E2,5-7]
C41  C-US050-030X075  [C050-030X075]
C42  C-US050-030X075  [C050-030X075]
C43  C-US050-030X075  [C050-030X075]
C44  CPOL-USE2.5-5  [E2,5-5]
C45  C-US050-030X075  [C050-030X075]
C46  CPOL-USE2.5-7  [E2,5-7]
C47  CPOL-USE2.5-7  [E2,5-7]
C48  C-US050-030X075  [C050-030X075]
C49  C-US050-030X075  [C050-030X075]
C50  C-US050-030X075  [C050-030X075]
C51  CPOL-USE2.5-5  [E2,5-5]
C52  C-US050-030X075  [C050-030X075]
C53  CPOL-USE2.5-7  [E2,5-7]
C54  CPOL-USE2.5-7  [E2,5-7]
C55  C-US050-030X075  [C050-030X075]
C56  CPOL-USE2.5-5  [E2,5-5]
C57  C-US050-030X075  [C050-030X075]
C58  CPOL-USE2.5-7  [E2,5-7]
C59  CPOL-USE2.5-7  [E2,5-7]
C60  C-US050-030X075  [C050-030X075]
C61  C-US050-030X075  [C050-030X075]
C62  C-US050-030X075  [C050-030X075]
C63  C-US050-030X075  [C050-030X075]
C64  C-US050-030X075  [C050-030X075]
C65  CPOL-USE2.5-5  [E2,5-5]
C66  C-US050-030X075  [C050-030X075]
C67  CPOL-USE2.5-7  [E2,5-7]
C68  CPOL-USE2.5-7  [E2,5-7]
C69  C-US050-030X075  [C050-030X075]
C70  C-US050-030X075  [C050-030X075]
C71  C-US050-030X075  [C050-030X075]
C72  CPOL-USE2.5-5  [E2,5-5]
C73  C-US050-030X075  [C050-030X075]
C74  CPOL-USE2.5-7  [E2,5-7]
C75  CPOL-USE2.5-7  [E2,5-7]
C76  C-US050-030X075  [C050-030X075]
C77  C-US050-030X075  [C050-030X075]
C78  C-US050-030X075  [C050-030X075]
C79  CPOL-USE2.5-5  [E2,5-5]
C80  C-US050-030X075  [C050-030X075]
C81  CPOL-USE2.5-7  [E2,5-7]
C82  CPOL-USE2.5-7  [E2,5-7]
C83  C-US050-030X075  [C050-030X075]
C84  CPOL-USE2.5-5  [E2,5-5]
C85  C-US050-030X075  [C050-030X075]
C86  CPOL-USE2.5-7  [E2,5-7]
C87  CPOL-USE2.5-7  [E2,5-7]
C88  C-US050-030X075  [C050-030X075]
C89  C-US050-030X075  [C050-030X075]
C90  C-US050-030X075  [C050-030X075]
C91  C-US050-030X075  [C050-030X075]
C92  C-US050-030X075  [C050-030X075]
C93  CPOL-USE2.5-5  [E2,5-5]
C94  C-US050-030X075  [C050-030X075]
C95  CPOL-USE2.5-7  [E2,5-7]
C96  CPOL-USE2.5-7  [E2,5-7]
C97  C-US050-030X075  [C050-030X075]
C98  C-US050-030X075  [C050-030X075]
C99  C-US050-030X075  [C050-030X075]
C100  CPOL-USE2.5-5  [E2,5-5]
C101  C-US050-030X075  [C050-030X075]
C102  CPOL-USE2.5-7  [E2,5-7]
C103  CPOL-USE2.5-7  [E2,5-7]
C104  C-US050-030X075  [C050-030X075]
C105  C-US050-030X075  [C050-030X075]
C106  C-US050-030X075  [C050-030X075]
C107  CPOL-USE2.5-5  [E2,5-5]
C108  C-US050-030X075  [C050-030X075]
C109  CPOL-USE2.5-7  [E2,5-7]
C110  CPOL-USE2.5-7  [E2,5-7]
C111  C-US050-030X075  [C050-030X075]
C112  CPOL-USE2.5-5  [E2,5-5]
C113  C-US050-030X075  [C050-030X075]
C114  CPOL-USE2.5-7  [E2,5-7]
C115  CPOL-USE2.5-7  [E2,5-7]
C116  C-US050-030X075  [C050-030X075]
C117  C-US050-030X075  [C050-030X075]
C118  C-US050-030X075  [C050-030X075]
C119  C-US050-030X075  [C050-030X075]
C120  C-US050-030X075  [C050-030X075]
C121  CPOL-USE2.5-5  [E2,5-5]
C122  C-US050-030X075  [C050-030X075]
C123  CPOL-USE2.5-7  [E2,5-7]
C124  CPOL-USE2.5-7  [E2,5-7]
C125  C-US050-030X075  [C050-030X075]
C126  C-US050-030X075  [C050-030X075]
C127  C-US050-030X075  [C050-030X075]
C128  CPOL-USE2.5-5  [E2,5-5]
C129  C-US050-030X075  [C050-030X075]
C130  CPOL-USE2.5-7  [E2,5-7]
C131  CPOL-USE2.5-7  [E2,5-7]
C132  C-US050-030X075  [C050-030X075]
C133  C-US050-030X075  [C050-030X075]
C134  C-US050-030X075  [C050-030X075]
C135  CPOL-USE2.5-5  [E2,5-5]
C136  C-US050-030X075  [C050-030X075]
C137  CPOL-USE2.5-7  [E2,5-7]
C138  CPOL-USE2.5-7  [E2,5-7]
C139  C-US050-030X075  [C050-030X075]
C140  CPOL-USE2.5-5  [E2,5-5]
C141  C-US050-030X075  [C050-030X075]
C142  CPOL-USE2.5-7  [E2,5-7]
C143  CPOL-USE2.5-7  [E2,5-7]
C144  C-US050-030X075  [C050-030X075]
C145  C-US050-030X075  [C050-030X075]
C146  C-US050-030X075  [C050-030X075]
C147  C-US050-030X075  [C050-030X075]
C148  C-US050-030X075  [C050-030X075]
C149  CPOL-USE2.5-5  [E2,5-5]
C150  C-US050-030X075  [C050-030X075]
C151  CPOL-USE2.5-7  [E2,5-7]
C152  CPOL-USE2.5-7  [E2,5-7]
C153  C-US050-030X075  [C050-030X075]
C154  C-US050-030X075  [C050-030X075]
C155  C-US050-030X075  [C050-030X075]
C156  CPOL-USE2.5-5  [E2,5-5]
C157  C-US050-030X075  [C050-030X075]
C158  CPOL-USE2.5-7  [E2,5-7]
C159  CPOL-USE2.5-7  [E2,5-7]
C160  C-US050-030X075  [C050-030X075]
C161  C-US050-030X075  [C050-030X075]
C162  C-US050-030X075  [C050-030X075]
C163  CPOL-USE2.5-5  [E2,5-5]
C164  C-US050-030X075  [C050-030X075]
C165  CPOL-USE2.5-7  [E2,5-7]
C166  CPOL-USE2.5-7  [E2,5-7]
C167  C-US050-030X075  [C050-030X075]
C168  CPOL-USE2.5-5  [E2,5-5]
C169  C-US050-030X075  [C050-030X075]
C170  CPOL-USE2.5-7  [E2,5-7]
C171  CPOL-USE2.5-7  [E2,5-7]
C172  C-US050-030X075  [C050-030X075]
C173  C-US050-030X075  [C050-030X075]
C174  C-US050-030X075  [C050-030X075]
C175  C-US050-030X075  [C050-030X075]
C176  C-US050-030X075  [C050-030X075]
C177  CPOL-USE2.5-5  [E2,5-5]
C178  C-US050-030X075  [C050-030X075]
C179  CPOL-USE2.5-7  [E2,5-7]
C180  CPOL-USE2.5-7  [E2,5-7]
C181  C-US050-030X075  [C050-030X075]
C182  C-US050-030X075  [C050-030X075]
C183  C-US050-030X075  [C050-030X075]
C184  CPOL-USE2.5-5  [E2,5-5]
C185  C-US050-030X075  [C050-030X075]
C186  CPOL-USE2.5-7  [E2,5-7]
C187  CPOL-USE2.5-7  [E2,5-7]
C188  C-US050-030X075  [C050-030X075]
C189  C-US050-030X075  [C050-030X075]
C190  C-US050-030X075  [C050-030X075]
C191  CPOL-USE2.5-5  [E2,5-5]
C192  C-US050-030X075  [C050-030X075]
C193  CPOL-USE2.5-7  [E2,5-7]
C194  CPOL-USE2.5-7  [E2,5-7]
C195  C-US050-030X075  [C050-030X075]
C196  CPOL-USE2.5-5  [E2,5-5]
C197  C-US050-030X075  [C050-030X075]
C198  CPOL-USE2.5-7  [E2,5-7]
C199  CPOL-USE2.5-7  [E2,5-7]
C200  C-US050-030X075  [C050-030X075]
C201  C-US050-030X075  [C050-030X075]
C202  C-US050-030X075  [C050-030X075]
C203  C-US050-030X075  [C050-030X075]
C204  C-US050-030X075  [C050-030X075]
C205  CPOL-USE2.5-5  [E2,5-5]
C206  C-US050-030X075  [C050-030X075]
C207  CPOL-USE2.5-7  [E2,5-7]
C208  CPOL-USE2.5-7  [E2,5-7]
C209  C-US050-030X075  [C050-030X075]
C210  C-US050-030X075  [C050-030X075]
C211  C-US050-030X075  [C050-030X075]
C212  CPOL-USE2.5-5  [E2,5-5]
C213  C-US050-030X075  [C050-030X075]
C214  CPOL-USE2.5-7  [E2,5-7]
C215  CPOL-USE2.5-7  [E2,5-7]
C216  C-US050-030X075  [C050-030X075]
C217  C-US050-030X075  [C050-030X075]
C218  C-US050-030X075  [C050-030X075]
C219  CPOL-USE2.5-5  [E2,5-5]
C220  C-US050-030X075  [C050-030X075]
C221  CPOL-USE2.5-7  [E2,5-7]
C222  CPOL-USE2.5-7  [E2,5-7]
C223  C-US050-030X075  [C050-030X075]
C224  CPOL-USE2.5-5  [E2,5-5]
C225  C-US050-030X075  [C050-030X075]
C226  CPOL-USE2.5-7  [E2,5-7]
C227  CPOL-USE2.5-7  [E2,5-7]
C228  C-US050-030X075  [C050-030X075]
C229  C-US050-030X075  [C050-030X075]
C230  C-US050-030X075  [C050-030X075]
C231  C-US050-030X075  [C050-030X075]
C232  C-US050-030X075  [C050-030X075]
C233  CPOL-USE2.5-5  [E2,5-5]
C234  C-US050-030X075  [C050-030X075]
C235  CPOL-USE2.5-7  [E2,5-7]
C236  CPOL-USE2.5-7  [E2,5-7]
C237  C-US050-030X075  [C050-030X075]
C238  C-US050-030X075  [C050-030X075]
C239  C-US050-030X075  [C050-030X075]
C240  CPOL-USE2.5-5  [E2,5-5]
C241  C-US050-030X075  [C050-030X075]
C242  CPOL-USE2.5-7  [E2,5-7]
C243  CPOL-USE2.5-7  [E2,5-7]
C244  C-US050-030X075  [C050-030X075]
C245  C-US050-030X075  [C050-030X075]
C246  C-US050-030X075  [C050-030X075]
C247  CPOL-USE2.5-5  [E2,5-5]
C248  C-US050-030X075  [C050-030X075]
C249  CPOL-USE2.5-7  [E2,5-7]
C250  CPOL-USE2.5-7  [E2,5-7]
C251  C-US050-030X075  [C050-030X075]
C252  CPOL-USE2.5-5  [E2,5-5]
C253  C-US050-030X075  [C050-030X075]
C254  CPOL-USE2.5-7  [E2,5-7]
C255  CPOL-USE2.5-7  [E2,5-7]
C256  C-US050-030X075  [C050-030X075]
C257  C-US050-030X075  [C050-030X075]
C258  C-US050-030X075  [C050-030X075]
C259  C-US050-030X075  [C050-030X075]
C260  C-US050-030X075  [C050-030X075]
C261  CPOL-USE2.5-5  [E2,5-5]
C262  C-US050-030X075  [C050-030X075]
C263  CPOL-USE2.5-7  [E2,5-7]
C264  CPOL-USE2.5-7  [E2,5-7]
C265  C-US050-030X075  [C050-030X075]
C266  C-US050-030X075  [C050-030X075]
C267  C-US050-030X075  [C050-030X075]
C268  CPOL-USE2.5-5  [E2,5-5]
C269  C-US050-030X075  [C050-030X075]
C270  CPOL-USE2.5-7  [E2,5-7]
C271  CPOL-USE2.5-7  [E2,5-7]
C272  C-US050-030X075  [C050-030X075]
C273  C-US050-030X075  [C050-030X075]
C274  C-US050-030X075  [C050-030X075]
C275  CPOL-USE2.5-5  [E2,5-5]
C276  C-US050-030X075  [C050-030X075]
C277  CPOL-USE2.5-7  [E2,5-7]
C278  CPOL-USE2.5-7  [E2,5-7]
C279  C-US050-030X075  [C050-030X075]
C280  CPOL-USE2.5-5  [E2,5-5]
C281  C-US050-030X075  [C050-030X075]
C282  CPOL-USE2.5-7  [E2,5-7]
C283  CPOL-USE2.5-7  [E2,5-7]
C284  C-US050-030X075  [C050-030X075]
C285  C-US050-030X075  [C050-030X075]
C286  C-US050-030X075  [C050-030X075]
C287  C-US050-030X075  [C050-030X075]
C288  C-US050-030X075  [C050-030X075]
C289  CPOL-USE2.5-5  [E2,5-5]
C290  C-US050-030X075  [C050-030X075]
C291  CPOL-USE2.5-7  [E2,5-7]
C292  CPOL-USE2.5-7  [E2,5-7]
C293  C-US050-030X075  [C050-030X075]
C294  C-US050-030X075  [C050-030X075]
C295  C-US050-030X075  [C050-030X075]
C296  C-US050-030X075  [C050-030X075]
C297  C-US050-030X075  [C050-030X075]
C298  C-US050-030X075  [C050-030X075]
C299  C-US050-030X075  [C050-030X075]
C300  C-US050-030X075  [C050-030X075]
C301  C-US050-030X075  [C050-030X075]
C302  C-US050-030X075  [C050-030X075]
C303  C-US050-030X075  [C050-030X075]
C304  C-US050-030X075  [C050-030X075]
C305  C-US050-030X075  [C050-030X075]
C306  C-US050-030X075  [C050-030X075]
C307  C-US050-030X075  [C050-030X075]
C308  C-US050-030X075  [C050-030X075]
C309  C-US050-030X075  [C050-030X075]
C310  C-US050-030X075  [C050-030X075]
C311  C-US050-030X075  [C050-030X075]
C312  C-US050-030X075  [C050-030X075]
C313  C-US050-030X075  [C050-030X075]
C314  C-US050-030X075  [C050-030X075]
C315  C-US050-030X075  [C050-030X075]
C316  C-US050-030X075  [C050-030X075]
C317  C-US050-030X075  [C050-030X075]
C318  C-US050-030X075  [C050-030X075]
C319  C-US050-030X075  [C050-030X075]
C320  C-US050-030X075  [C050-030X075]
C321  C-US050-030X075  [C050-030X075]
C322  C-US050-030X075  [C050-030X075]
C323  C-US050-030X075  [C050-030X075]
C324  C-US050-030X075  [C050-030X075]
C325  C-US050-030X075  [C050-030X075]
C326  C-US050-030X075  [C050-030X075]
C327  C-US050-030X075  [C050-030X075]
C328  C-US050-030X075  [C050-030X075]
C329  C-US050-030X075  [C050-030X075]
C330  C-US050-030X075  [C050-030X075]
C331  C-US050-030X075  [C050-030X075]
C332  C-US050-030X075  [C050-030X075]
C333  C-US050-030X075  [C050-030X075]
C334  C-US050-030X075  [C050-030X075]
C335  C-US050-030X075  [C050-030X075]
C336  C-US050-030X075  [C050-030X075]
C337  C-US050-030X075  [C050-030X075]
C338  C-US050-030X075  [C050-030X075]
C339  C-US050-030X075  [C050-030X075]
C340  C-US050-030X075  [C050-030X075]
C341  C-US050-030X075  [C050-030X075]
C342  C-US050-030X075  [C050-030X075]
C343  C-US050-030X075  [C050-030X075]
C344  C-US050-030X075  [C050-030X075]
C345  C-US050-030X075  [C050-030X075]
C346  C-US050-030X075  [C050-030X075]
C347  C-US050-030X075  [C050-030X075]
C348  C-US050-030X075  [C050-030X075]
C349  C-US050-030X075  [C050-030X075]
C350  C-US050-030X075  [C050-030X075]
C351  C-US050-030X075  [C050-030X075]
C352  C-US050-030X075  [C050-030X075]
C353  C-US050-030X075  [C050-030X075]
C354  C-US050-030X075  [C050-030X075]
C355  C-US050-030X075  [C050-030X075]
C356  C-US050-030X075  [C050-030X075]
C357  C-US050-030X075  [C050-030X075]
C358  C-US050-030X075  [C050-030X075]
C359  C-US050-030X075  [C050-030X075]
C360  C-US050-030X075  [C050-030X075]
C361  C-US050-030X075  [C050-030X075]
C362  C-US050-030X075  [C050-030X075]
C363  C-US050-030X075  [C050-030X075]
C364  C-US050-030X075  [C050-030X075]
IC1  ATMEGA88A-PU  [DIP794W53P254L3467H457Q28N]
IC2  MCP4921-E_P  [DIP781W56P254L950H533Q8N]
IC3  L78S24CV  [TO270P460X1020X2008-3P]
IC4  L78S24CV  [TO270P460X1020X2008-3P]
IC5  L7805CV  [TO270P460X1020X2008-3P]
IC6  CD4051BE  [DIP254P762X508-16]
IC7  CD4051BE  [DIP254P762X508-16]
IC8  CD4051BE  [DIP254P762X508-16]
IC9  CD4051BE  [DIP254P762X508-16]
IC10  CD4051BE  [DIP254P762X508-16]
IC11  CD4051BE  [DIP254P762X508-16]
IC12  CD4051BE  [DIP254P762X508-16]
IC13  CD4051BE  [DIP254P762X508-16]
IC14  CD4051BE  [DIP254P762X508-16]
IC15  LM324N  [DIP794W56P254L1905H533Q14N]
IC16  LM324N  [DIP794W56P254L1905H533Q14N]
IC17  LM324N  [DIP794W56P254L1905H533Q14N]
IC18  LM324N  [DIP794W56P254L1905H533Q14N]
IC19  LM324N  [DIP794W56P254L1905H533Q14N]
IC20  LM324N  [DIP794W56P254L1905H533Q14N]
IC21  LM324N  [DIP794W56P254L1905H533Q14N]
IC22  LM324N  [DIP794W56P254L1905H533Q14N]
IC23  LM324N  [DIP794W56P254L1905H533Q14N]
IC24  LM324N  [DIP794W56P254L1905H533Q14N]
IC25  LM324N  [DIP794W56P254L1905H533Q14N]
IC26  LM324N  [DIP794W56P254L1905H533Q14N]
IC27  LM324N  [DIP794W56P254L1905H533Q14N]
IC28  LM324N  [DIP794W56P254L1905H533Q14N]
IC29  LM324N  [DIP794W56P254L1905H533Q14N]
IC30  LM324N  [DIP794W56P254L1905H533Q14N]
IC31  LM324N  [DIP794W56P254L1905H533Q14N]
IC32  LM324N  [DIP794W56P254L1905H533Q14N]
IC33  LM324N  [DIP794W56P254L1905H533Q14N]
IC34  LM324N  [DIP794W56P254L1905H533Q14N]
IC35  LM324N  [DIP794W56P254L1905H533Q14N]
IC36  LM324N  [DIP794W56P254L1905H533Q14N]
IC37  LM324N  [DIP794W56P254L1905H533Q14N]
IC38  LM324N  [DIP794W56P254L1905H533Q14N]
IC39  LM324N  [DIP794W56P254L1905H533Q14N]
IC40  LM324N  [DIP794W56P254L1905H533Q14N]
IC41  LM324N  [DIP794W56P254L1905H533Q14N]
IC42  LM324N  [DIP794W56P254L1905H533Q14N]
IC43  LM324N  [DIP794W56P254L1905H533Q14N]
IC44  LM324N  [DIP794W56P254L1905H533Q14N]
IC45  LM324N  [DIP794W56P254L1905H533Q14N]
IC46  LM324N  [DIP794W56P254L1905H533Q14N]
IC47  LM324N  [DIP794W56P254L1905H533Q14N]
IC48  LM324N  [DIP794W56P254L1905H533Q14N]
IC49  LM324N  [DIP794W56P254L1905H533Q14N]
IC50  LM324N  [DIP794W56P254L1905H533Q14N]
IC51  LM324N  [DIP794W56P254L1905H533Q14N]
IC52  LM324N  [DIP794W56P254L1905H533Q14N]
IC53  LM324N  [DIP794W56P254L1905H533Q14N]
IC54  LM324N  [DIP794W56P254L1905H533Q14N]
IC55  LM324N  [DIP794W56P254L1905H533Q14N]
IC56  LM324N  [DIP794W56P254L1905H533Q14N]
IC57  LM324N  [DIP794W56P254L1905H533Q14N]
IC58  LM324N  [DIP794W56P254L1905H533Q14N]
IC59  LM324N  [DIP794W56P254L1905H533Q14N]
IC60  LM324N  [DIP794W56P254L1905H533Q14N]
IC61  LM324N  [DIP794W56P254L1905H533Q14N]
IC62  LM324N  [DIP794W56P254L1905H533Q14N]
IC63  LM324N  [DIP794W56P254L1905H533Q14N]
IC64  LM324N  [DIP794W56P254L1905H533Q14N]
IC65  LM324N  [DIP794W56P254L1905H533Q14N]
IC66  LM324N  [DIP794W56P254L1905H533Q14N]
IC67  LM324N  [DIP794W56P254L1905H533Q14N]
IC68  LM324N  [DIP794W56P254L1905H533Q14N]
IC69  LM324N  [DIP794W56P254L1905H533Q14N]
IC70  LM324N  [DIP794W56P254L1905H533Q14N]
IC71  LM324N  [DIP794W56P254L1905H533Q14N]
IC72  LM324N  [DIP794W56P254L1905H533Q14N]
IC73  LM324N  [DIP794W56P254L1905H533Q14N]
IC74  LM324N  [DIP794W56P254L1905H533Q14N]
IC75  LM324N  [DIP794W56P254L1905H533Q14N]
IC76  LM324N  [DIP794W56P254L1905H533Q14N]
IC77  CD4051BE  [DIP254P762X508-16]
IC78  CD4051BE  [DIP254P762X508-16]
IC79  CD4051BE  [DIP254P762X508-16]
IC80  CD4051BE  [DIP254P762X508-16]
IC81  CD4051BE  [DIP254P762X508-16]
IC82  CD4051BE  [DIP254P762X508-16]
IC83  CD4051BE  [DIP254P762X508-16]
IC84  CD4051BE  [DIP254P762X508-16]
IC85  CD4051BE  [DIP254P762X508-16]
IC86  ATMEGA88A-PU  [DIP794W53P254L3467H457Q28N]
IC87  MCP4921-E_P  [DIP781W56P254L950H533Q8N]
IC88  ATMEGA88A-PU  [DIP794W53P254L3467H457Q28N]
IC89  MCP4921-E_P  [DIP781W56P254L950H533Q8N]
IC90  ATMEGA88A-PU  [DIP794W53P254L3467H457Q28N]
IC91  MCP4921-E_P  [DIP781W56P254L950H533Q8N]
IC92  ATMEGA88A-PU  [DIP794W53P254L3467H457Q28N]
IC93  MCP4921-E_P  [DIP781W56P254L950H533Q8N]
IC94  ATMEGA88A-PU  [DIP794W53P254L3467H457Q28N]
IC95  MCP4921-E_P  [DIP781W56P254L950H533Q8N]
IC96  ATMEGA88A-PU  [DIP794W53P254L3467H457Q28N]
IC97  MCP4921-E_P  [DIP781W56P254L950H533Q8N]
IC98  ATMEGA88A-PU  [DIP794W53P254L3467H457Q28N]
IC99  MCP4921-E_P  [DIP781W56P254L950H533Q8N]
IC100  ATMEGA88A-PU  [DIP794W53P254L3467H457Q28N]
IC101  MCP4921-E_P  [DIP781W56P254L950H533Q8N]
IC102  ATMEGA88A-PU  [DIP794W53P254L3467H457Q28N]
IC103  MCP4921-E_P  [DIP781W56P254L950H533Q8N]
IC104  ATMEGA88A-PU  [DIP794W53P254L3467H457Q28N]
IC105  MCP4921-E_P  [DIP781W56P254L950H533Q8N]
IC106  ATMEGA88A-PU  [DIP794W53P254L3467H457Q28N]
IC107  MCP4921-E_P  [DIP781W56P254L950H533Q8N]
IC108  ATMEGA88A-PU  [DIP794W53P254L3467H457Q28N]
IC109  MCP4921-E_P  [DIP781W56P254L950H533Q8N]
IC110  ATMEGA88A-PU  [DIP794W53P254L3467H457Q28N]
IC111  MCP4921-E_P  [DIP781W56P254L950H533Q8N]
IC112  ATMEGA88A-PU  [DIP794W53P254L3467H457Q28N]
IC113  MCP4921-E_P  [DIP781W56P254L950H533Q8N]
IC114  ATMEGA88A-PU  [DIP794W53P254L3467H457Q28N]
IC115  MCP4921-E_P  [DIP781W56P254L950H533Q8N]
IC116  ATMEGA88A-PU  [DIP794W53P254L3467H457Q28N]
IC117  MCP4921-E_P  [DIP781W56P254L950H533Q8N]
IC118  ATMEGA88A-PU  [DIP794W53P254L3467H457Q28N]
IC119  MCP4921-E_P  [DIP781W56P254L950H533Q8N]
IC120  ATMEGA88A-PU  [DIP794W53P254L3467H457Q28N]
IC121  MCP4921-E_P  [DIP781W56P254L950H533Q8N]
IC122  ATMEGA88A-PU  [DIP794W53P254L3467H457Q28N]
IC123  MCP4921-E_P  [DIP781W56P254L950H533Q8N]
IC124  ATMEGA88A-PU  [DIP794W53P254L3467H457Q28N]
IC125  MCP4921-E_P  [DIP781W56P254L950H533Q8N]
IC126  ATMEGA88A-PU  [DIP794W53P254L3467H457Q28N]
IC127  MCP4921-E_P  [DIP781W56P254L950H533Q8N]
IC128  ATMEGA88A-PU  [DIP794W53P254L3467H457Q28N]
IC129  MCP4921-E_P  [DIP781W56P254L950H533Q8N]
IC130  ATMEGA88A-PU  [DIP794W53P254L3467H457Q28N]
IC131  MCP4921-E_P  [DIP781W56P254L950H533Q8N]
IC132  ATMEGA88A-PU  [DIP794W53P254L3467H457Q28N]
IC133  MCP4921-E_P  [DIP781W56P254L950H533Q8N]
IC134  TBD62783APG  [DIP762W55P254L2286H480Q18N]
IC135  TBD62783APG  [DIP762W55P254L2286H480Q18N]
IC136  TBD62783APG  [DIP762W55P254L2286H480Q18N]
ISP1  AVRISP-BOX  [AVRISP-BOX]
ISP2  AVRISP-BOX  [AVRISP-BOX]
ISP3  AVRISP-BOX  [AVRISP-BOX]
ISP4  AVRISP-BOX  [AVRISP-BOX]
ISP5  AVRISP-BOX  [AVRISP-BOX]
ISP6  AVRISP-BOX  [AVRISP-BOX]
ISP7  AVRISP-BOX  [AVRISP-BOX]
ISP8  AVRISP-BOX  [AVRISP-BOX]
ISP9  AVRISP-BOX  [AVRISP-BOX]
ISP10  AVRISP-BOX  [AVRISP-BOX]
ISP11  AVRISP-BOX  [AVRISP-BOX]
ISP12  AVRISP-BOX  [AVRISP-BOX]
ISP13  AVRISP-BOX  [AVRISP-BOX]
ISP14  AVRISP-BOX  [AVRISP-BOX]
ISP15  AVRISP-BOX  [AVRISP-BOX]
ISP16  AVRISP-BOX  [AVRISP-BOX]
ISP17  AVRISP-BOX  [AVRISP-BOX]
ISP18  AVRISP-BOX  [AVRISP-BOX]
ISP19  AVRISP-BOX  [AVRISP-BOX]
ISP20  AVRISP-BOX  [AVRISP-BOX]
ISP21  AVRISP-BOX  [AVRISP-BOX]
ISP22  AVRISP-BOX  [AVRISP-BOX]
ISP23  AVRISP-BOX  [AVRISP-BOX]
ISP24  AVRISP-BOX  [AVRISP-BOX]
ISP25  AVRISP-BOX  [AVRISP-BOX]
J1  CONN_025MM  [SCREWTERMINAL-5MM-2]
J2  CONN_025MM  [SCREWTERMINAL-5MM-2]
J3  30326-6002HB  [SHDR26W81P254_2X13_4060X840X94]
J4  30316-6002HB  [3M-30316-6002HB]
J5  30326-6002HB  [SHDR26W81P254_2X13_4060X840X94]
J6  22-23-2061  [SHDR6W87P0X254_1X6_1509X635X10]
J7  22-23-2061  [SHDR6W87P0X254_1X6_1509X635X10]
J8  22-23-2061  [SHDR6W87P0X254_1X6_1509X635X10]
J9  22-23-2061  [SHDR6W87P0X254_1X6_1509X635X10]
J10  22-23-2061  [SHDR6W87P0X254_1X6_1509X635X10]
J11  22-23-2061  [SHDR6W87P0X254_1X6_1509X635X10]
J12  22-23-2061  [SHDR6W87P0X254_1X6_1509X635X10]
J13  22-23-2061  [SHDR6W87P0X254_1X6_1509X635X10]
J14  22-23-2061  [SHDR6W87P0X254_1X6_1509X635X10]
J15  22-23-2061  [SHDR6W87P0X254_1X6_1509X635X10]
J16  22-23-2061  [SHDR6W87P0X254_1X6_1509X635X10]
J17  22-23-2061  [SHDR6W87P0X254_1X6_1509X635X10]
J18  22-23-2061  [SHDR6W87P0X254_1X6_1509X635X10]
J19  22-23-2061  [SHDR6W87P0X254_1X6_1509X635X10]
J20  22-23-2061  [SHDR6W87P0X254_1X6_1509X635X10]
J21  22-23-2061  [SHDR6W87P0X254_1X6_1509X635X10]
J22  22-23-2061  [SHDR6W87P0X254_1X6_1509X635X10]
J23  22-23-2061  [SHDR6W87P0X254_1X6_1509X635X10]
J24  22-23-2061  [SHDR6W87P0X254_1X6_1509X635X10]
J25  22-23-2061  [SHDR6W87P0X254_1X6_1509X635X10]
J26  22-23-2061  [SHDR6W87P0X254_1X6_1509X635X10]
J27  22-23-2061  [SHDR6W87P0X254_1X6_1509X635X10]
J28  22-23-2061  [SHDR6W87P0X254_1X6_1509X635X10]
J29  22-23-2061  [SHDR6W87P0X254_1X6_1509X635X10]
J30  22-23-2061  [SHDR6W87P0X254_1X6_1509X635X10]
R1  R-US_0207/10  [0207/10]
R2  R-US_0207/10  [0207/10]
R3  R-US_0207/10  [0207/10]
R4  R-US_0207/10  [0207/10]
R5  R-US_0207/10  [0207/10]
R6  R-US_0207/10  [0207/10]
R7  R-US_0207/10  [0207/10]
R8  R-US_0207/10  [0207/10]
R9  R-US_0207/10  [0207/10]
R10  R-US_0207/10  [0207/10]
R11  R-US_0207/10  [0207/10]
R12  R-US_0207/10  [0207/10]
R13  R-US_0207/10  [0207/10]
R14  R-US_0207/10  [0207/10]
R15  R-US_0207/10  [0207/10]
R16  R-US_0207/10  [0207/10]
R17  R-US_0207/10  [0207/10]
R18  R-US_0207/10  [0207/10]
R19  R-US_0207/10  [0207/10]
R20  R-US_0207/10  [0207/10]
R21  R-US_0207/10  [0207/10]
R22  R-US_0207/10  [0207/10]
R23  R-US_0207/10  [0207/10]
R24  R-US_0207/10  [0207/10]
R25  R-US_0207/10  [0207/10]
R26  R-US_0207/10  [0207/10]
R27  R-US_0207/10  [0207/10]
R28  R-US_0207/10  [0207/10]
R29  R-US_0207/10  [0207/10]
R30  R-US_0207/10  [0207/10]
R31  R-US_0207/10  [0207/10]
R32  R-US_0207/10  [0207/10]
R33  R-US_0207/10  [0207/10]
R34  R-US_0207/10  [0207/10]
R35  R-US_0207/10  [0207/10]
R36  R-US_0207/10  [0207/10]
R37  R-US_0207/10  [0207/10]
R38  R-US_0207/10  [0207/10]
R39  R-US_0207/10  [0207/10]
R40  R-US_0207/10  [0207/10]
R41  R-US_0207/10  [0207/10]
R42  R-US_0207/10  [0207/10]
R43  R-US_0207/10  [0207/10]
R44  R-US_0207/10  [0207/10]
R45  R-US_0207/10  [0207/10]
R46  R-US_0207/10  [0207/10]
R47  R-US_0207/10  [0207/10]
R48  R-US_0207/10  [0207/10]
R49  R-US_0207/10  [0207/10]
R50  R-US_0207/10  [0207/10]
R51  R-US_0207/10  [0207/10]
R52  R-US_0207/10  [0207/10]
R53  R-US_0207/10  [0207/10]
R54  R-US_0207/10  [0207/10]
R55  R-US_0207/10  [0207/10]
R56  R-US_0207/10  [0207/10]
R57  R-US_0207/10  [0207/10]
R58  R-US_0207/10  [0207/10]
R59  R-US_0207/10  [0207/10]
R60  R-US_0207/10  [0207/10]
R61  R-US_0207/10  [0207/10]
R62  R-US_0207/10  [0207/10]
R63  R-US_0207/10  [0207/10]
R64  R-US_0207/10  [0207/10]
R65  R-US_0207/10  [0207/10]
R66  R-US_0207/10  [0207/10]
R67  R-US_0207/10  [0207/10]
R68  R-US_0207/10  [0207/10]
R69  R-US_0207/10  [0207/10]
R70  R-US_0207/10  [0207/10]
R71  R-US_0207/10  [0207/10]
R72  R-US_0207/10  [0207/10]
R73  R-US_0207/10  [0207/10]
R74  R-US_0207/10  [0207/10]
R75  R-US_0207/10  [0207/10]
R76  R-US_0207/10  [0207/10]
R77  R-US_0207/10  [0207/10]
R78  R-US_0207/10  [0207/10]
R79  R-US_0207/10  [0207/10]
R80  R-US_0207/10  [0207/10]
R81  R-US_0207/10  [0207/10]
R82  R-US_0207/10  [0207/10]
R83  R-US_0207/10  [0207/10]
R84  R-US_0207/10  [0207/10]
R85  R-US_0207/10  [0207/10]
R86  R-US_0207/10  [0207/10]
R87  R-US_0207/10  [0207/10]
R88  R-US_0207/10  [0207/10]
R89  R-US_0207/10  [0207/10]
R90  R-US_0207/10  [0207/10]
R91  R-US_0207/10  [0207/10]
R92  R-US_0207/10  [0207/10]
R93  R-US_0207/10  [0207/10]
R94  R-US_0207/10  [0207/10]
R95  R-US_0207/10  [0207/10]
R96  R-US_0207/10  [0207/10]
R97  R-US_0207/10  [0207/10]
R98  R-US_0207/10  [0207/10]
R99  R-US_0207/10  [0207/10]
R100  R-US_0207/10  [0207/10]
R101  R-US_0207/10  [0207/10]
R102  R-US_0207/10  [0207/10]
R103  R-US_0207/10  [0207/10]
R104  R-US_0207/10  [0207/10]
R105  R-US_0207/10  [0207/10]
R106  R-US_0207/10  [0207/10]
R107  R-US_0207/10  [0207/10]
R108  R-US_0207/10  [0207/10]
R109  R-US_0207/10  [0207/10]
R110  R-US_0207/10  [0207/10]
R111  R-US_0207/10  [0207/10]
R112  R-US_0207/10  [0207/10]
R113  R-US_0207/10  [0207/10]
R114  R-US_0207/10  [0207/10]
R115  R-US_0207/10  [0207/10]
R116  R-US_0207/10  [0207/10]
R117  R-US_0207/10  [0207/10]
R118  R-US_0207/10  [0207/10]
R119  R-US_0207/10  [0207/10]
R120  R-US_0207/10  [0207/10]
R121  R-US_0207/10  [0207/10]
R122  R-US_0207/10  [0207/10]
R123  R-US_0207/10  [0207/10]
R124  R-US_0207/10  [0207/10]
R125  R-US_0207/10  [0207/10]
R126  R-US_0207/10  [0207/10]
R127  R-US_0207/10  [0207/10]
R128  R-US_0207/10  [0207/10]
R129  R-US_0207/10  [0207/10]
R130  R-US_0207/10  [0207/10]
R131  R-US_0207/10  [0207/10]
R132  R-US_0207/10  [0207/10]
R133  R-US_0207/10  [0207/10]
R134  R-US_0207/10  [0207/10]
R135  R-US_0207/10  [0207/10]
R136  R-US_0207/10  [0207/10]
R137  R-US_0207/10  [0207/10]
R138  R-US_0207/10  [0207/10]
R139  R-US_0207/10  [0207/10]
R140  R-US_0207/10  [0207/10]
R141  R-US_0207/10  [0207/10]
R142  R-US_0207/10  [0207/10]
R143  R-US_0207/10  [0207/10]
R144  R-US_0207/10  [0207/10]
R145  R-US_0207/10  [0207/10]
R146  R-US_0207/10  [0207/10]
R147  R-US_0207/10  [0207/10]
R148  R-US_0207/10  [0207/10]
R149  R-US_0207/10  [0207/10]
R150  R-US_0207/10  [0207/10]
R151  R-US_0207/10  [0207/10]
R152  R-US_0207/10  [0207/10]
R153  R-US_0207/10  [0207/10]
R154  R-US_0207/10  [0207/10]
R155  R-US_0207/10  [0207/10]
R156  R-US_0207/10  [0207/10]
R157  R-US_0207/10  [0207/10]
R158  R-US_0207/10  [0207/10]
R159  R-US_0207/10  [0207/10]
R160  R-US_0207/10  [0207/10]
R161  R-US_0207/10  [0207/10]
R162  R-US_0207/10  [0207/10]
R163  R-US_0207/10  [0207/10]
R164  R-US_0207/10  [0207/10]
R165  R-US_0207/10  [0207/10]
R166  R-US_0207/10  [0207/10]
R167  R-US_0207/10  [0207/10]
R168  R-US_0207/10  [0207/10]
R169  R-US_0207/10  [0207/10]
R170  R-US_0207/10  [0207/10]
R171  R-US_0207/10  [0207/10]
R172  R-US_0207/10  [0207/10]
R173  R-US_0207/10  [0207/10]
R174  R-US_0207/10  [0207/10]
R175  R-US_0207/10  [0207/10]
R176  R-US_0207/10  [0207/10]
R177  R-US_0207/10  [0207/10]
R178  R-US_0207/10  [0207/10]
R179  R-US_0207/10  [0207/10]
R180  R-US_0207/10  [0207/10]
R181  R-US_0207/10  [0207/10]
R182  R-US_0207/10  [0207/10]
R183  R-US_0207/10  [0207/10]
R184  R-US_0207/10  [0207/10]
R185  R-US_0207/10  [0207/10]
R186  R-US_0207/10  [0207/10]
R187  R-US_0207/10  [0207/10]
R188  R-US_0207/10  [0207/10]
R189  R-US_0207/10  [0207/10]
R190  R-US_0207/10  [0207/10]
R191  R-US_0207/10  [0207/10]
R192  R-US_0207/10  [0207/10]
R193  R-US_0207/10  [0207/10]
R194  R-US_0207/10  [0207/10]
R195  R-US_0207/10  [0207/10]
R196  R-US_0207/10  [0207/10]
R197  R-US_0207/10  [0207/10]
R198  R-US_0207/10  [0207/10]
R199  R-US_0207/10  [0207/10]
R200  R-US_0207/10  [0207/10]
R201  R-US_0207/10  [0207/10]
R202  R-US_0207/10  [0207/10]
R203  R-US_0207/10  [0207/10]
R204  R-US_0207/10  [0207/10]
R205  R-US_0207/10  [0207/10]
R206  R-US_0207/10  [0207/10]
R207  R-US_0207/10  [0207/10]
R208  R-US_0207/10  [0207/10]
R209  R-US_0207/10  [0207/10]
R210  R-US_0207/10  [0207/10]
R211  R-US_0207/10  [0207/10]
R212  R-US_0207/10  [0207/10]
R213  R-US_0207/10  [0207/10]
R214  R-US_0207/10  [0207/10]
R215  R-US_0207/10  [0207/10]
R216  R-US_0207/10  [0207/10]
R217  R-US_0207/10  [0207/10]
R218  R-US_0207/10  [0207/10]
R219  R-US_0207/10  [0207/10]
R220  R-US_0207/10  [0207/10]
R221  R-US_0207/10  [0207/10]
R222  R-US_0207/10  [0207/10]
R223  R-US_0207/10  [0207/10]
R224  R-US_0207/10  [0207/10]
R225  R-US_0207/10  [0207/10]
R226  R-US_0207/10  [0207/10]
R227  R-US_0207/10  [0207/10]
R228  R-US_0207/10  [0207/10]
R229  R-US_0207/10  [0207/10]
R230  R-US_0207/10  [0207/10]
R231  R-US_0207/10  [0207/10]
R232  R-US_0207/10  [0207/10]
R233  R-US_0207/10  [0207/10]
R234  R-US_0207/10  [0207/10]
R235  R-US_0207/10  [0207/10]
R236  R-US_0207/10  [0207/10]
R237  R-US_0207/10  [0207/10]
R238  R-US_0207/10  [0207/10]
R239  R-US_0207/10  [0207/10]
R240  R-US_0207/10  [0207/10]
R241  R-US_0207/10  [0207/10]
R242  R-US_0207/10  [0207/10]
R243  R-US_0207/10  [0207/10]
R244  R-US_0207/10  [0207/10]
R245  R-US_0207/10  [0207/10]
R246  R-US_0207/10  [0207/10]
R247  R-US_0207/10  [0207/10]
R248  R-US_0207/10  [0207/10]
R249  R-US_0207/10  [0207/10]
R250  R-US_0207/10  [0207/10]
R251  R-US_0207/10  [0207/10]
R252  R-US_0207/10  [0207/10]
R253  R-US_0207/10  [0207/10]
R254  R-US_0207/10  [0207/10]
R255  R-US_0207/10  [0207/10]
R256  R-US_0207/10  [0207/10]
R257  R-US_0207/10  [0207/10]
R258  R-US_0207/10  [0207/10]
R259  R-US_0207/10  [0207/10]
R260  R-US_0207/10  [0207/10]
R261  R-US_0207/10  [0207/10]
R262  R-US_0207/10  [0207/10]
R263  R-US_0207/10  [0207/10]
R264  R-US_0207/10  [0207/10]
R265  R-US_0207/10  [0207/10]
R266  R-US_0207/10  [0207/10]
R267  R-US_0207/10  [0207/10]
R268  R-US_0207/10  [0207/10]
R269  R-US_0207/10  [0207/10]
R270  R-US_0207/10  [0207/10]
R271  R-US_0207/10  [0207/10]
R272  R-US_0207/10  [0207/10]
R273  R-US_0207/10  [0207/10]
R274  R-US_0207/10  [0207/10]
R275  R-US_0207/10  [0207/10]
R276  R-US_0207/10  [0207/10]
R277  R-US_0207/10  [0207/10]
R278  R-US_0207/10  [0207/10]
R279  R-US_0207/10  [0207/10]
R280  R-US_0207/10  [0207/10]
R281  R-US_0207/10  [0207/10]
R282  R-US_0207/10  [0207/10]
R283  R-US_0207/10  [0207/10]
R284  R-US_0207/10  [0207/10]
R285  R-US_0207/10  [0207/10]
R286  R-US_0207/10  [0207/10]
R287  R-US_0207/10  [0207/10]
R288  R-US_0207/10  [0207/10]
R289  R-US_0207/10  [0207/10]
R290  R-US_0207/10  [0207/10]
R291  R-US_0207/10  [0207/10]
R292  R-US_0207/10  [0207/10]
R293  R-US_0207/10  [0207/10]
R294  R-US_0207/10  [0207/10]
R295  R-US_0207/10  [0207/10]
R296  R-US_0207/10  [0207/10]
R297  R-US_0207/10  [0207/10]
R298  R-US_0207/10  [0207/10]
R299  R-US_0207/10  [0207/10]
R300  R-US_0207/10  [0207/10]
R301  R-US_0207/10  [0207/10]
R302  R-US_0207/10  [0207/10]
R303  R-US_0207/10  [0207/10]
R304  R-US_0207/10  [0207/10]
R305  R-US_0207/10  [0207/10]
R306  R-US_0207/10  [0207/10]
R307  R-US_0207/10  [0207/10]
R308  R-US_0207/10  [0207/10]
R309  R-US_0207/10  [0207/10]
R310  R-US_0207/10  [0207/10]
R311  R-US_0207/10  [0207/10]
R312  R-US_0207/10  [0207/10]
R313  R-US_0207/10  [0207/10]
R314  R-US_0207/10  [0207/10]
R315  R-US_0207/10  [0207/10]
R316  R-US_0207/10  [0207/10]
R317  R-US_0207/10  [0207/10]
R318  R-US_0207/10  [0207/10]
R319  R-US_0207/10  [0207/10]
R320  R-US_0207/10  [0207/10]
R321  R-US_0207/10  [0207/10]
R322  R-US_0207/10  [0207/10]
R323  R-US_0207/10  [0207/10]
R324  R-US_0207/10  [0207/10]
R325  R-US_0207/10  [0207/10]
R326  R-US_0207/10  [0207/10]
R327  R-US_0207/10  [0207/10]
R328  R-US_0207/10  [0207/10]
R329  R-US_0207/10  [0207/10]
R330  R-US_0207/10  [0207/10]
R331  R-US_0207/10  [0207/10]
R332  R-US_0207/10  [0207/10]
R333  R-US_0207/10  [0207/10]
R334  R-US_0207/10  [0207/10]
R335  R-US_0207/10  [0207/10]
R336  R-US_0207/10  [0207/10]
R337  R-US_0207/10  [0207/10]
R338  R-US_0207/10  [0207/10]
R339  R-US_0207/10  [0207/10]
R340  R-US_0207/10  [0207/10]
R341  R-US_0207/10  [0207/10]
R342  R-US_0207/10  [0207/10]
R343  R-US_0207/10  [0207/10]
R344  R-US_0207/10  [0207/10]
R345  R-US_0207/10  [0207/10]
R346  R-US_0207/10  [0207/10]
R347  R-US_0207/10  [0207/10]
R348  R-US_0207/10  [0207/10]
R349  R-US_0207/10  [0207/10]
R350  R-US_0207/10  [0207/10]
R351  R-US_0207/10  [0207/10]
R352  R-US_0207/10  [0207/10]
R353  R-US_0207/10  [0207/10]
R354  R-US_0207/10  [0207/10]
R355  R-US_0207/10  [0207/10]
R356  R-US_0207/10  [0207/10]
R357  R-US_0207/10  [0207/10]
R358  R-US_0207/10  [0207/10]
R359  R-US_0207/10  [0207/10]
R360  R-US_0207/10  [0207/10]
R361  R-US_0207/10  [0207/10]
R362  R-US_0207/10  [0207/10]
R363  R-US_0207/10  [0207/10]
R364  R-US_0207/10  [0207/10]
R365  R-US_0207/10  [0207/10]
R366  R-US_0207/10  [0207/10]
R367  R-US_0207/10  [0207/10]
R368  R-US_0207/10  [0207/10]
R369  R-US_0207/10  [0207/10]
R370  R-US_0207/10  [0207/10]
R371  R-US_0207/10  [0207/10]
R372  R-US_0207/10  [0207/10]
R373  R-US_0207/10  [0207/10]
R374  R-US_0207/10  [0207/10]
R375  R-US_0207/10  [0207/10]
R376  R-US_0207/10  [0207/10]
R377  R-US_0207/10  [0207/10]
R378  R-US_0207/10  [0207/10]
R379  R-US_0207/10  [0207/10]
R380  R-US_0207/10  [0207/10]
R381  R-US_0207/10  [0207/10]
R382  R-US_0207/10  [0207/10]
R383  R-US_0207/10  [0207/10]
R384  R-US_0207/10  [0207/10]
R385  R-US_0207/10  [0207/10]
R386  R-US_0207/10  [0207/10]
R387  R-US_0207/10  [0207/10]
R388  R-US_0207/10  [0207/10]
R389  R-US_0207/10  [0207/10]
R390  R-US_0207/10  [0207/10]
R391  R-US_0207/10  [0207/10]
R392  R-US_0207/10  [0207/10]
R393  R-US_0207/10  [0207/10]
R394  R-US_0207/10  [0207/10]
R395  R-US_0207/10  [0207/10]
R396  R-US_0207/10  [0207/10]
R397  R-US_0207/10  [0207/10]
R398  R-US_0207/10  [0207/10]
R399  R-US_0207/10  [0207/10]
R400  R-US_0207/10  [0207/10]
R401  R-US_0207/10  [0207/10]
R402  R-US_0207/10  [0207/10]
R403  R-US_0207/10  [0207/10]
R404  R-US_0207/10  [0207/10]
R405  R-US_0207/10  [0207/10]
R406  R-US_0207/10  [0207/10]
R407  R-US_0207/10  [0207/10]
R408  R-US_0207/10  [0207/10]
R409  R-US_0207/10  [0207/10]
R410  R-US_0207/10  [0207/10]
R411  R-US_0207/10  [0207/10]
R412  R-US_0207/10  [0207/10]
R413  R-US_0207/10  [0207/10]
R414  R-US_0207/10  [0207/10]
R415  R-US_0207/10  [0207/10]
R416  R-US_0207/10  [0207/10]
R417  R-US_0207/10  [0207/10]
R418  R-US_0207/10  [0207/10]
R419  R-US_0207/10  [0207/10]
R420  R-US_0207/10  [0207/10]
R421  R-US_0207/10  [0207/10]
R422  R-US_0207/10  [0207/10]
R423  R-US_0207/10  [0207/10]
R424  R-US_0207/10  [0207/10]
R425  R-US_0207/10  [0207/10]
R426  R-US_0207/10  [0207/10]
R427  R-US_0207/10  [0207/10]
R428  R-US_0207/10  [0207/10]
R429  R-US_0207/10  [0207/10]
R430  R-US_0207/10  [0207/10]
R431  R-US_0207/10  [0207/10]
R432  R-US_0207/10  [0207/10]
R433  R-US_0207/10  [0207/10]
R434  R-US_0207/10  [0207/10]
R435  R-US_0207/10  [0207/10]
R436  R-US_0207/10  [0207/10]
R437  R-US_0207/10  [0207/10]
R438  R-US_0207/10  [0207/10]
R439  R-US_0207/10  [0207/10]
R440  R-US_0207/10  [0207/10]
R441  R-US_0207/10  [0207/10]
R442  R-US_0207/10  [0207/10]
R443  R-US_0207/10  [0207/10]
R444  R-US_0207/10  [0207/10]
R445  R-US_0207/10  [0207/10]
R446  R-US_0207/10  [0207/10]
R447  R-US_0207/10  [0207/10]
R448  R-US_0207/10  [0207/10]
R449  R-US_0207/10  [0207/10]
R450  R-US_0207/10  [0207/10]
R451  R-US_0207/10  [0207/10]
R452  R-US_0207/10  [0207/10]
R453  R-US_0207/10  [0207/10]
R454  R-US_0207/10  [0207/10]
R455  R-US_0207/10  [0207/10]
R456  R-US_0207/10  [0207/10]
R457  R-US_0207/10  [0207/10]
R458  R-US_0207/10  [0207/10]
R459  R-US_0207/10  [0207/10]
R460  R-US_0207/10  [0207/10]
R461  R-US_0207/10  [0207/10]
R462  R-US_0207/10  [0207/10]
R463  R-US_0207/10  [0207/10]
R464  R-US_0207/10  [0207/10]
R465  R-US_0207/10  [0207/10]
R466  R-US_0207/10  [0207/10]
R467  R-US_0207/10  [0207/10]
R468  R-US_0207/10  [0207/10]
R469  R-US_0207/10  [0207/10]
R470  R-US_0207/10  [0207/10]
R471  R-US_0207/10  [0207/10]
R472  R-US_0207/10  [0207/10]
R473  R-US_0207/10  [0207/10]
R474  R-US_0207/10  [0207/10]
R475  R-US_0207/10  [0207/10]
R476  R-US_0207/10  [0207/10]
R477  R-US_0207/10  [0207/10]
R478  R-US_0207/10  [0207/10]
R479  R-US_0207/10  [0207/10]
R480  R-US_0207/10  [0207/10]
R481  R-US_0207/10  [0207/10]
R482  R-US_0207/10  [0207/10]
R483  R-US_0207/10  [0207/10]
R484  R-US_0207/10  [0207/10]
R485  R-US_0207/10  [0207/10]
R486  R-US_0207/10  [0207/10]
R487  R-US_0207/10  [0207/10]
R488  R-US_0207/10  [0207/10]
R489  R-US_0207/10  [0207/10]
R490  R-US_0207/10  [0207/10]
R491  R-US_0207/10  [0207/10]
R492  R-US_0207/10  [0207/10]
R493  R-US_0207/10  [0207/10]
R494  R-US_0207/10  [0207/10]
R495  R-US_0207/10  [0207/10]
R496  R-US_0207/10  [0207/10]
R497  R-US_0207/10  [0207/10]
R498  R-US_0207/10  [0207/10]
R499  R-US_0207/10  [0207/10]
R500  R-US_0207/10  [0207/10]
R501  R-US_0207/10  [0207/10]
R502  R-US_0207/10  [0207/10]
R503  R-US_0207/10  [0207/10]
R504  R-US_0207/10  [0207/10]
R505  R-US_0207/10  [0207/10]
R506  R-US_0207/10  [0207/10]
R507  R-US_0207/10  [0207/10]
R508  R-US_0207/10  [0207/10]
R509  R-US_0207/10  [0207/10]
R510  R-US_0207/10  [0207/10]
R511  R-US_0207/10  [0207/10]
R512  R-US_0207/10  [0207/10]
R513  R-US_0207/10  [0207/10]
R514  R-US_0207/10  [0207/10]
R515  R-US_0207/10  [0207/10]
R516  R-US_0207/10  [0207/10]
R517  R-US_0207/10  [0207/10]
R518  R-US_0207/10  [0207/10]
R519  R-US_0207/10  [0207/10]
R520  R-US_0207/10  [0207/10]
R521  R-US_0207/10  [0207/10]
R522  R-US_0207/10  [0207/10]
R523  R-US_0207/10  [0207/10]
R524  R-US_0207/10  [0207/10]
R525  R-US_0207/10  [0207/10]
R526  R-US_0207/10  [0207/10]
R527  R-US_0207/10  [0207/10]
R528  R-US_0207/10  [0207/10]
R529  R-US_0207/10  [0207/10]
R530  R-US_0207/10  [0207/10]
R531  R-US_0207/10  [0207/10]
R532  R-US_0207/10  [0207/10]
R533  R-US_0207/10  [0207/10]
R534  R-US_0207/10  [0207/10]
R535  R-US_0207/10  [0207/10]
R536  R-US_0207/10  [0207/10]
R537  R-US_0207/10  [0207/10]
R538  R-US_0207/10  [0207/10]
R539  R-US_0207/10  [0207/10]
R540  R-US_0207/10  [0207/10]
R541  R-US_0207/10  [0207/10]
R542  R-US_0207/10  [0207/10]
R543  R-US_0207/10  [0207/10]
R544  R-US_0207/10  [0207/10]
R545  R-US_0207/10  [0207/10]
R546  R-US_0207/10  [0207/10]
R547  R-US_0207/10  [0207/10]
R548  R-US_0207/10  [0207/10]
R549  R-US_0207/10  [0207/10]
R550  R-US_0207/10  [0207/10]
R551  R-US_0207/10  [0207/10]
R552  R-US_0207/10  [0207/10]
R553  R-US_0207/10  [0207/10]
R554  R-US_0207/10  [0207/10]
R555  R-US_0207/10  [0207/10]
R556  R-US_0207/10  [0207/10]
R557  R-US_0207/10  [0207/10]
R558  R-US_0207/10  [0207/10]
R559  R-US_0207/10  [0207/10]
R560  R-US_0207/10  [0207/10]
R561  R-US_0207/10  [0207/10]
R562  R-US_0207/10  [0207/10]
R563  R-US_0207/10  [0207/10]
R564  R-US_0207/10  [0207/10]
R565  R-US_0207/10  [0207/10]
R566  R-US_0207/10  [0207/10]
R567  R-US_0207/10  [0207/10]
R568  R-US_0207/10  [0207/10]
R569  R-US_0207/10  [0207/10]
R570  R-US_0207/10  [0207/10]
R571  R-US_0207/10  [0207/10]
R572  R-US_0207/10  [0207/10]
R573  R-US_0207/10  [0207/10]
R574  R-US_0207/10  [0207/10]
R575  R-US_0207/10  [0207/10]
R576  R-US_0207/10  [0207/10]
R577  R-US_0207/10  [0207/10]
R578  R-US_0207/10  [0207/10]
R579  R-US_0207/10  [0207/10]
R580  R-US_0207/10  [0207/10]
R581  R-US_0207/10  [0207/10]
R582  R-US_0207/10  [0207/10]
R583  R-US_0207/10  [0207/10]
R584  R-US_0207/10  [0207/10]
R585  R-US_0207/10  [0207/10]
R586  R-US_0207/10  [0207/10]
R587  R-US_0207/10  [0207/10]
R588  R-US_0207/10  [0207/10]
R589  R-US_0207/10  [0207/10]
R590  R-US_0207/10  [0207/10]
R591  R-US_0207/10  [0207/10]
R592  R-US_0207/10  [0207/10]
R593  R-US_0207/10  [0207/10]
R594  R-US_0207/10  [0207/10]
R595  R-US_0207/10  [0207/10]
R596  R-US_0207/10  [0207/10]
R597  R-US_0207/10  [0207/10]
R598  R-US_0207/10  [0207/10]
R599  R-US_0207/10  [0207/10]
R600  R-US_0207/10  [0207/10]
R601  R-US_0207/10  [0207/10]
R602  R-US_0207/10  [0207/10]
R603  R-US_0207/10  [0207/10]
R604  R-US_0207/10  [0207/10]
R605  R-US_0207/10  [0207/10]
R606  R-US_0207/10  [0207/10]
R607  R-US_0207/10  [0207/10]
R608  R-US_0207/10  [0207/10]
R609  R-US_0207/10  [0207/10]
R610  R-US_0207/10  [0207/10]
R611  R-US_0207/10  [0207/10]
R612  R-US_0207/10  [0207/10]
R613  R-US_0207/10  [0207/10]
R614  R-US_0207/10  [0207/10]
R615  R-US_0207/10  [0207/10]
R616  R-US_0207/10  [0207/10]
R617  R-US_0207/10  [0207/10]
R618  R-US_0207/10  [0207/10]
R619  R-US_0207/10  [0207/10]
R620  R-US_0207/10  [0207/10]
R621  R-US_0207/10  [0207/10]
R622  R-US_0207/10  [0207/10]
R623  R-US_0207/10  [0207/10]
R624  R-US_0207/10  [0207/10]
R625  R-US_0207/10  [0207/10]
R626  R-US_0207/10  [0207/10]
R627  R-US_0207/10  [0207/10]
Y1  16MHz  CRYSTAL-16MHZPTH-HC49US  [HC49US]
Y2  16MHz  CRYSTAL-16MHZPTH-HC49US  [HC49US]
Y3  16MHz  CRYSTAL-16MHZPTH-HC49US  [HC49US]
Y4  16MHz  CRYSTAL-16MHZPTH-HC49US  [HC49US]
Y5  16MHz  CRYSTAL-16MHZPTH-HC49US  [HC49US]
Y6  16MHz  CRYSTAL-16MHZPTH-HC49US  [HC49US]
Y7  16MHz  CRYSTAL-16MHZPTH-HC49US  [HC49US]
Y8  16MHz  CRYSTAL-16MHZPTH-HC49US  [HC49US]
Y9  16MHz  CRYSTAL-16MHZPTH-HC49US  [HC49US]
Y10  16MHz  CRYSTAL-16MHZPTH-HC49US  [HC49US]
Y11  16MHz  CRYSTAL-16MHZPTH-HC49US  [HC49US]
Y12  16MHz  CRYSTAL-16MHZPTH-HC49US  [HC49US]
Y13  16MHz  CRYSTAL-16MHZPTH-HC49US  [HC49US]
Y14  16MHz  CRYSTAL-16MHZPTH-HC49US  [HC49US]
Y15  16MHz  CRYSTAL-16MHZPTH-HC49US  [HC49US]
Y16  16MHz  CRYSTAL-16MHZPTH-HC49US  [HC49US]
Y17  16MHz  CRYSTAL-16MHZPTH-HC49US  [HC49US]
Y18  16MHz  CRYSTAL-16MHZPTH-HC49US  [HC49US]
Y19  16MHz  CRYSTAL-16MHZPTH-HC49US  [HC49US]
Y20  16MHz  CRYSTAL-16MHZPTH-HC49US  [HC49US]
Y21  16MHz  CRYSTAL-16MHZPTH-HC49US  [HC49US]
Y22  16MHz  CRYSTAL-16MHZPTH-HC49US  [HC49US]
Y23  16MHz  CRYSTAL-16MHZPTH-HC49US  [HC49US]
Y24  16MHz  CRYSTAL-16MHZPTH-HC49US  [HC49US]
Y25  16MHz  CRYSTAL-16MHZPTH-HC49US  [HC49US]

## Nets
+5V: C3.1 C12.+ C295.1 C298.1 C301.1 C304.1 C307.1 C310.1 C313.1 C316.1 C319.1 C322.1 C325.1 C328.1 C331.1 C334.1 C337.1 C340.1 C343.1 C346.1 C349.1 C352.1 C355.1 C358.1 C361.1 C364.1 IC1.7(VCC) IC1.20(AVCC) IC1.21(AREF) IC2.1(VDD) IC2.6(VREF) IC5.3(OUTPUT) IC6.16(VDD) IC7.16(VDD) IC8.16(VDD) IC9.16(VDD) IC10.16(VDD) IC11.16(VDD) IC12.16(VDD) IC13.16(VDD) IC14.16(VDD) IC16.5(INPUT_2+) IC77.16(VDD) IC78.16(VDD) IC79.16(VDD) IC80.16(VDD) IC81.16(VDD) IC82.16(VDD) IC83.16(VDD) IC84.16(VDD) IC85.16(VDD) IC86.7(VCC) IC86.20(AVCC) IC86.21(AREF) IC87.1(VDD) IC87.6(VREF) IC88.7(VCC) IC88.20(AVCC) IC88.21(AREF) IC89.1(VDD) IC89.6(VREF) IC90.7(VCC) IC90.20(AVCC) IC90.21(AREF) IC91.1(VDD) IC91.6(VREF) IC92.7(VCC) IC92.20(AVCC) IC92.21(AREF) IC93.1(VDD) IC93.6(VREF) IC94.7(VCC) IC94.20(AVCC) IC94.21(AREF) IC95.1(VDD) IC95.6(VREF) IC96.7(VCC) IC96.20(AVCC) IC96.21(AREF) IC97.1(VDD) IC97.6(VREF) IC98.7(VCC) IC98.20(AVCC) IC98.21(AREF) IC99.1(VDD) IC99.6(VREF) IC100.7(VCC) IC100.20(AVCC) IC100.21(AREF) IC101.1(VDD) IC101.6(VREF) IC102.7(VCC) IC102.20(AVCC) IC102.21(AREF) IC103.1(VDD) IC103.6(VREF) IC104.7(VCC) IC104.20(AVCC) IC104.21(AREF) IC105.1(VDD) IC105.6(VREF) IC106.7(VCC) IC106.20(AVCC) IC106.21(AREF) IC107.1(VDD) IC107.6(VREF) IC108.7(VCC) IC108.20(AVCC) IC108.21(AREF) IC109.1(VDD) IC109.6(VREF) IC110.7(VCC) IC110.20(AVCC) IC110.21(AREF) IC111.1(VDD) IC111.6(VREF) IC112.7(VCC) IC112.20(AVCC) IC112.21(AREF) IC113.1(VDD) IC113.6(VREF) IC114.7(VCC) IC114.20(AVCC) IC114.21(AREF) IC115.1(VDD) IC115.6(VREF) IC116.7(VCC) IC116.20(AVCC) IC116.21(AREF) IC117.1(VDD) IC117.6(VREF) IC118.7(VCC) IC118.20(AVCC) IC118.21(AREF) IC119.1(VDD) IC119.6(VREF) IC120.7(VCC) IC120.20(AVCC) IC120.21(AREF) IC121.1(VDD) IC121.6(VREF) IC122.7(VCC) IC122.20(AVCC) IC122.21(AREF) IC123.1(VDD) IC123.6(VREF) IC124.7(VCC) IC124.20(AVCC) IC124.21(AREF) IC125.1(VDD) IC125.6(VREF) IC126.7(VCC) IC126.20(AVCC) IC126.21(AREF) IC127.1(VDD) IC127.6(VREF) IC128.7(VCC) IC128.20(AVCC) IC128.21(AREF) IC129.1(VDD) IC129.6(VREF) IC130.7(VCC) IC130.20(AVCC) IC130.21(AREF) IC131.1(VDD) IC131.6(VREF) IC132.7(VCC) IC132.20(AVCC) IC132.21(AREF) IC133.1(VDD) IC133.6(VREF) ISP1.2(VCC) ISP2.2(VCC) ISP3.2(VCC) ISP4.2(VCC) ISP5.2(VCC) ISP6.2(VCC) ISP7.2(VCC) ISP8.2(VCC) ISP9.2(VCC) ISP10.2(VCC) ISP11.2(VCC) ISP12.2(VCC) ISP13.2(VCC) ISP14.2(VCC) ISP15.2(VCC) ISP16.2(VCC) ISP17.2(VCC) ISP18.2(VCC) ISP19.2(VCC) ISP20.2(VCC) ISP21.2(VCC) ISP22.2(VCC) ISP23.2(VCC) ISP24.2(VCC) ISP25.2(VCC) J3.1 R1.1 R4.2 R10.2 R16.1 R22.1 R28.2 R34.2 R40.1 R46.1 R52.2 R58.2 R64.1 R70.1 R76.2 R82.2 R88.1 R94.1 R100.2 R106.2 R112.1 R118.1 R124.2 R130.2 R136.1 R142.1 R148.2 R154.2 R160.1 R166.1 R172.2 R178.2 R184.1 R190.1 R196.2 R202.2 R208.1 R214.1 R220.2 R226.2 R232.1 R238.1 R604.1 R605.1 R606.1 R607.1 R608.1 R609.1 R610.1 R611.1 R612.1 R613.1 R614.1 R615.1 R616.1 R617.1 R618.1 R619.1 R620.1 R621.1 R622.1 R623.1 R624.1 R625.1 R626.1 R627.1
+24V: C6.+ C10.+ C11.+ IC3.3(OUT) IC5.1(INPUT) IC16.4(V+) IC17.4(V+) IC18.4(V+) IC19.4(V+) IC20.4(V+) IC21.4(V+) IC22.4(V+) IC23.4(V+) IC24.4(V+) IC25.4(V+) IC26.4(V+) IC27.4(V+) IC28.4(V+) IC29.4(V+) IC30.4(V+) IC31.4(V+) IC32.4(V+) IC33.4(V+) IC34.4(V+) IC35.4(V+) IC36.4(V+) IC37.4(V+) IC38.4(V+) IC39.4(V+) IC40.4(V+) IC41.4(V+) IC42.4(V+) IC43.4(V+) IC44.4(V+) IC45.4(V+) IC46.4(V+) IC47.4(V+) IC48.4(V+) IC49.4(V+) IC50.4(V+) IC51.4(V+) IC52.4(V+) IC53.4(V+) IC54.4(V+) IC55.4(V+) IC56.4(V+) IC57.4(V+) IC58.4(V+) IC59.4(V+) IC60.4(V+) IC61.4(V+) IC62.4(V+) IC63.4(V+) IC64.4(V+) IC65.4(V+) IC66.4(V+) IC67.4(V+) IC68.4(V+) IC69.4(V+) IC70.4(V+) IC71.4(V+) IC72.4(V+) IC73.4(V+) IC74.4(V+) IC75.4(V+) IC76.4(V+) IC134.9(VCC) IC135.9(VCC) IC136.9(VCC) J4.1
-24V: C7.- C8.- C9.- IC4.2(GND) IC16.11(GND) IC17.11(GND) IC18.11(GND) IC19.11(GND) IC20.11(GND) IC21.11(GND) IC22.11(GND) IC23.11(GND) IC24.11(GND) IC25.11(GND) IC26.11(GND) IC27.11(GND) IC28.11(GND) IC29.11(GND) IC30.11(GND) IC31.11(GND) IC32.11(GND) IC33.11(GND) IC34.11(GND) IC35.11(GND) IC36.11(GND) IC37.11(GND) IC38.11(GND) IC39.11(GND) IC40.11(GND) IC41.11(GND) IC42.11(GND) IC43.11(GND) IC44.11(GND) IC45.11(GND) IC46.11(GND) IC47.11(GND) IC48.11(GND) IC49.11(GND) IC50.11(GND) IC51.11(GND) IC52.11(GND) IC53.11(GND) IC54.11(GND) IC55.11(GND) IC56.11(GND) IC57.11(GND) IC58.11(GND) IC59.11(GND) IC60.11(GND) IC61.11(GND) IC62.11(GND) IC63.11(GND) IC64.11(GND) IC65.11(GND) IC66.11(GND) IC67.11(GND) IC68.11(GND) IC69.11(GND) IC70.11(GND) IC71.11(GND) IC72.11(GND) IC73.11(GND) IC74.11(GND) IC75.11(GND) IC76.11(GND) J2.1
A0: IC1.4([PCINT18/INT0]_PD2) IC6.11(A)
A1: IC1.28(PC5_[ADC5/SCL/PCINT13]) IC77.11(A)
ADC00: IC1.23(PC0_[ADC0/PCINT8]) IC15.6(INPUT_2-) IC15.7(OUTPUT_2)
B0: IC1.5([PCINT19/OC2B/INT1]_PD3) IC6.10(B)
B1: IC1.27(PC4_[ADC4/SDA/PCINT12]) IC77.10(B)
C0: IC1.6([PCINT20/XCK/T0]_PD4) IC6.9(C)
C1: IC1.26(PC3_[ADC3/PCINT11]) IC77.9(C)
D0: IC1.11([PCINT21/OC0B/T1]_PD5) IC7.11(A) IC8.11(A) IC9.11(A) IC10.11(A) IC11.11(A) IC12.11(A) IC13.11(A) IC14.11(A)
D1: IC1.25(PC2_[ADC2/PCINT10]) IC78.11(A) IC79.11(A) IC80.11(A) IC81.11(A) IC82.11(A) IC83.11(A) IC84.11(A) IC85.11(A)
DAC00: IC2.8(VOUT) IC15.10(INPUT_3+)
DAC01: IC87.8(VOUT) IC134.1(I1)
DAC02: IC89.8(VOUT) IC134.2(I2)
DAC03: IC91.8(VOUT) IC134.3(I3)
DAC04: IC93.8(VOUT) IC134.4(I4)
DAC05: IC95.8(VOUT) IC134.5(I5)
DAC06: IC97.8(VOUT) IC134.6(I6)
DAC07: IC99.8(VOUT) IC134.7(I7)
DAC08: IC101.8(VOUT) IC134.8(I8)
DAC09: IC103.8(VOUT) IC135.1(I1)
DAC10: IC105.8(VOUT) IC135.2(I2)
DAC11: IC107.8(VOUT) IC135.3(I3)
DAC12: IC109.8(VOUT) IC135.4(I4)
DAC13: IC111.8(VOUT) IC135.5(I5)
DAC14: IC113.8(VOUT) IC135.6(I6)
DAC15: IC115.8(VOUT) IC135.7(I7)
DAC16: IC117.8(VOUT) IC135.8(I8)
DAC17: IC119.8(VOUT) IC136.1(I1)
DAC18: IC121.8(VOUT) IC136.2(I2)
DAC19: IC123.8(VOUT) IC136.3(I3)
DAC20: IC125.8(VOUT) IC136.4(I4)
DAC21: IC127.8(VOUT) IC136.5(I5)
DAC22: IC129.8(VOUT) IC136.6(I6)
DAC23: IC131.8(VOUT) IC136.7(I7)
DAC24: IC133.8(VOUT) IC136.8(I8)
DEMUX00: IC78.13(CHANNELS_IN/OUT_0) IC86.23(PC0_[ADC0/PCINT8])
DEMUX01: IC78.14(CHANNELS_IN/OUT_1) IC88.23(PC0_[ADC0/PCINT8])
DEMUX02: IC78.15(CHANNELS_IN/OUT_2) IC90.23(PC0_[ADC0/PCINT8])
DEMUX03: IC78.12(CHANNELS_IN/OUT_3) IC92.23(PC0_[ADC0/PCINT8])
DEMUX04: IC78.1(CHANNELS_IN/OUT_4) IC94.23(PC0_[ADC0/PCINT8])
DEMUX05: IC78.5(CHANNELS_IN/OUT_5) IC96.23(PC0_[ADC0/PCINT8])
DEMUX06: IC78.2(CHANNELS_IN/OUT_6) IC98.23(PC0_[ADC0/PCINT8])
DEMUX07: IC78.4(CHANNELS_IN/OUT_7) IC100.23(PC0_[ADC0/PCINT8])
DEMUX08: IC79.13(CHANNELS_IN/OUT_0) IC102.23(PC0_[ADC0/PCINT8])
DEMUX09: IC79.14(CHANNELS_IN/OUT_1) IC104.23(PC0_[ADC0/PCINT8])
DEMUX10: IC79.15(CHANNELS_IN/OUT_2) IC106.23(PC0_[ADC0/PCINT8])
DEMUX11: IC79.12(CHANNELS_IN/OUT_3) IC108.23(PC0_[ADC0/PCINT8])
DEMUX12: IC79.1(CHANNELS_IN/OUT_4) IC110.23(PC0_[ADC0/PCINT8])
DEMUX13: IC79.5(CHANNELS_IN/OUT_5) IC112.23(PC0_[ADC0/PCINT8])
DEMUX14: IC79.2(CHANNELS_IN/OUT_6) IC114.23(PC0_[ADC0/PCINT8])
DEMUX15: IC79.4(CHANNELS_IN/OUT_7) IC116.23(PC0_[ADC0/PCINT8])
DEMUX16: IC80.13(CHANNELS_IN/OUT_0) IC118.23(PC0_[ADC0/PCINT8])
DEMUX17: IC80.14(CHANNELS_IN/OUT_1) IC120.23(PC0_[ADC0/PCINT8])
DEMUX18: IC80.15(CHANNELS_IN/OUT_2) IC122.23(PC0_[ADC0/PCINT8])
DEMUX19: IC80.12(CHANNELS_IN/OUT_3) IC124.23(PC0_[ADC0/PCINT8])
DEMUX20: IC80.1(CHANNELS_IN/OUT_4) IC126.23(PC0_[ADC0/PCINT8])
DEMUX21: IC80.5(CHANNELS_IN/OUT_5) IC128.23(PC0_[ADC0/PCINT8])
DEMUX22: IC80.2(CHANNELS_IN/OUT_6) IC130.23(PC0_[ADC0/PCINT8])
DEMUX23: IC80.4(CHANNELS_IN/OUT_7) IC132.23(PC0_[ADC0/PCINT8])
DEMUX24: IC81.13(CHANNELS_IN/OUT_0)
DEMUX25: IC81.14(CHANNELS_IN/OUT_1)
DEMUX26: IC81.15(CHANNELS_IN/OUT_2)
DEMUX27: IC81.12(CHANNELS_IN/OUT_3)
DEMUX28: IC81.1(CHANNELS_IN/OUT_4)
DEMUX29: IC81.5(CHANNELS_IN/OUT_5)
DEMUX30: IC81.2(CHANNELS_IN/OUT_6)
DEMUX31: IC81.4(CHANNELS_IN/OUT_7)
DEMUX32: IC82.13(CHANNELS_IN/OUT_0)
DEMUX33: IC82.14(CHANNELS_IN/OUT_1)
DEMUX34: IC82.15(CHANNELS_IN/OUT_2)
DEMUX35: IC82.12(CHANNELS_IN/OUT_3)
DEMUX36: IC82.1(CHANNELS_IN/OUT_4)
DEMUX37: IC82.5(CHANNELS_IN/OUT_5)
DEMUX38: IC82.2(CHANNELS_IN/OUT_6)
DEMUX39: IC82.4(CHANNELS_IN/OUT_7)
DEMUX40: IC83.13(CHANNELS_IN/OUT_0)
DEMUX41: IC83.14(CHANNELS_IN/OUT_1)
DEMUX42: IC83.15(CHANNELS_IN/OUT_2)
DEMUX43: IC83.12(CHANNELS_IN/OUT_3)
DEMUX44: IC83.1(CHANNELS_IN/OUT_4)
DEMUX45: IC83.5(CHANNELS_IN/OUT_5)
DEMUX46: IC83.2(CHANNELS_IN/OUT_6)
DEMUX47: IC83.4(CHANNELS_IN/OUT_7)
DEMUX48: IC84.13(CHANNELS_IN/OUT_0)
DEMUX49: IC84.14(CHANNELS_IN/OUT_1)
DEMUX50: IC84.15(CHANNELS_IN/OUT_2)
DEMUX51: IC84.12(CHANNELS_IN/OUT_3)
DEMUX52: IC84.1(CHANNELS_IN/OUT_4)
DEMUX53: IC84.5(CHANNELS_IN/OUT_5)